# Altium project Flight Controller.PrjPcb
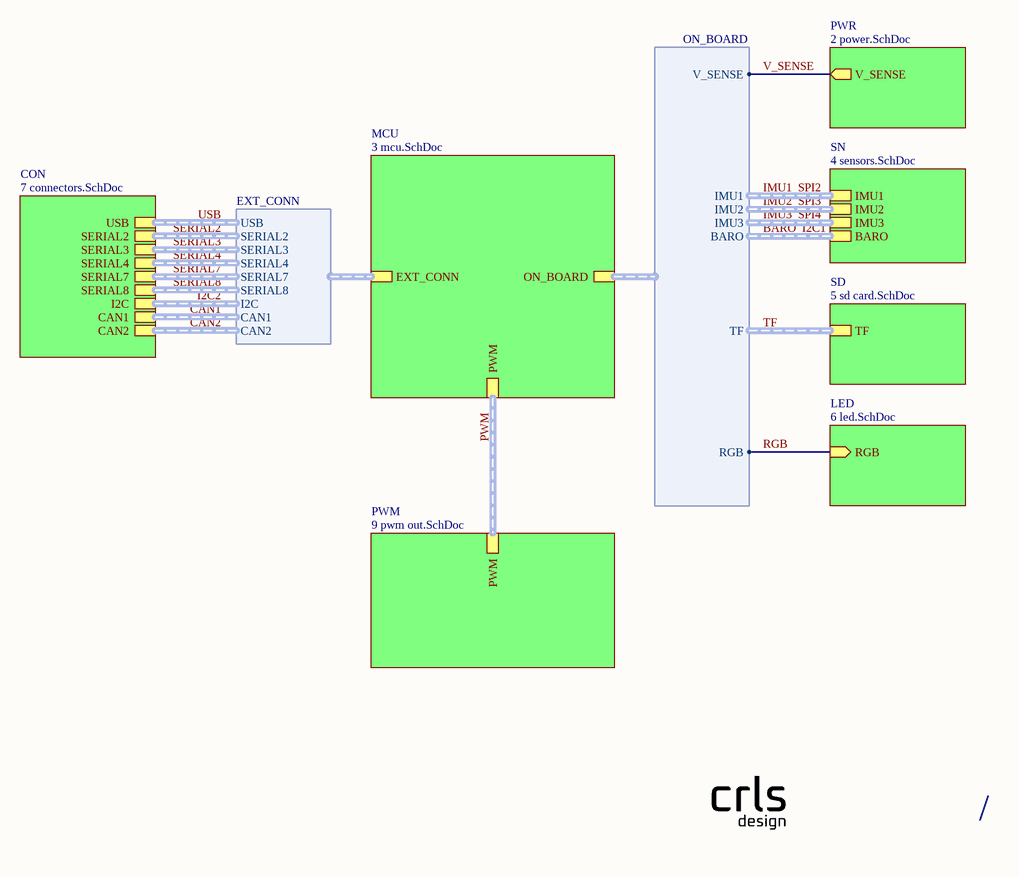
[diagram p0: 1 top.SchDoc]
9 sheets, 153 parts. Net scope: hierarchical (ports join the sheet entries above them; power ports are global).
Board files: main.PcbDoc, panel.PcbDoc
Sheets:
  1 top.SchDoc
    MCU = 3 mcu.SchDoc
    SN = 4 sensors.SchDoc
    SD = 5 sd card.SchDoc
    LED = 6 led.SchDoc
    PWR = 2 power.SchDoc
    CON = 7 connectors.SchDoc
      CT = 8 can transceiver.SchDoc
      CT = 8 can transceiver.SchDoc
    PWM = 9 pwm out.SchDoc

## Sheet 1 top.SchDoc
size A4; SheetNumber: 1; SheetTotal: 9

### Sub-sheets
CON = 7 connectors.SchDoc: USB, SERIAL2, SERIAL4, SERIAL8, CAN1, CAN2, I2C, SERIAL7, SERIAL3
LED = 6 led.SchDoc: RGB (in)
MCU = 3 mcu.SchDoc: ON_BOARD (harness ON_BOARD), EXT_CONN (harness EXT_CONN), PWM (harness PWM)
PWM = 9 pwm out.SchDoc: PWM (harness PWM)
PWR = 2 power.SchDoc: V_SENSE (out)
SD = 5 sd card.SchDoc: TF
SN = 4 sensors.SchDoc: IMU1, BARO, IMU2, IMU3

### Harnesses
ON_BOARD: IMU1, BARO, TF, RGB, V_SENSE, IMU2, IMU3
EXT_CONN: USB, SERIAL2, SERIAL3, SERIAL4, SERIAL7, SERIAL8, I2C, CAN1, CAN2

### Nets
RGB: sheet LED/RGB, sheet MCU/ON_BOARD.RGB
V_SENSE: sheet PWR/V_SENSE, sheet MCU/ON_BOARD.V_SENSE

### Buses and harness runs
harness BARO_I2C1 = sheet SN/BARO
harness CAN1 = sheet CON/CAN1
harness CAN2 = sheet CON/CAN2
harness I2C2 = sheet CON/I2C
harness IMU1_SPI2 = sheet SN/IMU1
harness IMU2_SPI3 = sheet SN/IMU2
harness IMU3_SPI4 = sheet SN/IMU3
harness PWM = sheet MCU/PWM = sheet PWM/PWM
harness SERIAL2 = sheet CON/SERIAL2
harness SERIAL3 = sheet CON/SERIAL3
harness SERIAL4 = sheet CON/SERIAL4
harness SERIAL7 = sheet CON/SERIAL7
harness SERIAL8 = sheet CON/SERIAL8
harness TF = sheet SD/TF
harness USB = sheet CON/USB

### Notes on the sheet
- /

## Sheet 3 mcu.SchDoc
size A4; SheetNumber: 3; SheetTotal: 9
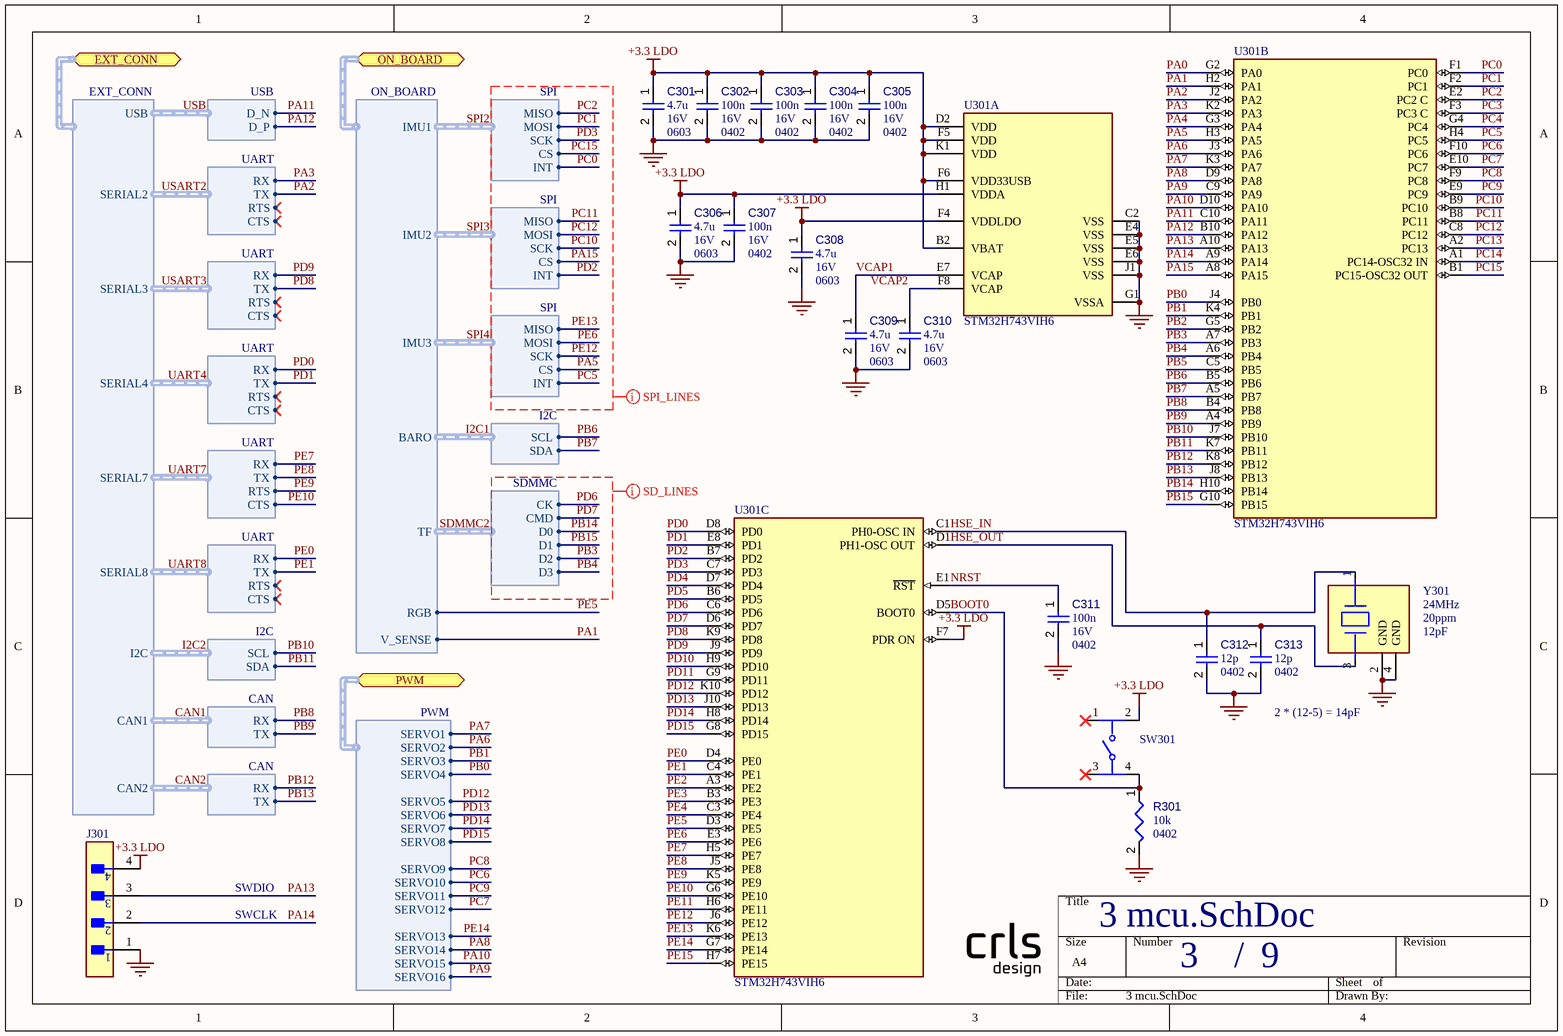
[diagram p1: 3 mcu.SchDoc]

### Parts
C301  value 4.7u  Case/Package: 0603  Voltage Rating: 16V  [CAPC0603(1608)100_L]  (hidden comment: Capacitors,0603,4.7u,16V)
C302  value 100n  Case/Package: 0402  Voltage Rating: 16V  [CAPC0402(1005)60_L]  (hidden comment: Capacitors,0402,100n,16V)
C303  value 100n  Case/Package: 0402  Voltage Rating: 16V  [CAPC0402(1005)60_L]  (hidden comment: Capacitors,0402,100n,16V)
C304  value 100n  Case/Package: 0402  Voltage Rating: 16V  [CAPC0402(1005)60_L]  (hidden comment: Capacitors,0402,100n,16V)
C305  value 100n  Case/Package: 0402  Voltage Rating: 16V  [CAPC0402(1005)60_L]  (hidden comment: Capacitors,0402,100n,16V)
C306  value 4.7u  Case/Package: 0603  Voltage Rating: 16V  [CAPC0603(1608)100_L]  (hidden comment: Capacitors,0603,4.7u,16V)
C307  value 100n  Case/Package: 0402  Voltage Rating: 16V  [CAPC0402(1005)60_L]  (hidden comment: Capacitors,0402,100n,16V)
C308  value 4.7u  Case/Package: 0603  Voltage Rating: 16V  [CAPC0603(1608)100_L]  (hidden comment: Capacitors,0603,4.7u,16V)
C309  value 4.7u  Case/Package: 0603  Voltage Rating: 16V  [CAPC0603(1608)100_L]  (hidden comment: Capacitors,0603,4.7u,16V)
C310  value 4.7u  Case/Package: 0603  Voltage Rating: 16V  [CAPC0603(1608)100_L]  (hidden comment: Capacitors,0603,4.7u,16V)
C311  value 100n  Case/Package: 0402  Voltage Rating: 16V  [CAPC0402(1005)60_L]  (hidden comment: Capacitors,0402,100n,16V)
C312  value 12p  Case/Package: 0402  [CAPC0402(1005)60_L]  (hidden comment: Capacitors,0402,12p)
C313  value 12p  Case/Package: 0402  [CAPC0402(1005)60_L]  (hidden comment: Capacitors,0402,12p)
J301  MTLW-104-05-G-S-185  [FP-MTLW-104-05-G-S-185-MFG]  (value not drawn)
R301  value 10k  Case/Package: 0402  [RESC0402(1005)_L]  (hidden comment: Resistors,0402,1%,10k)
SW301  PTS810 SJG 250 SMTR LFS  [FP-PTS810_SJG_250_SMTR_LF-MFG]  (value not drawn)
U301  STM32H743VIH6  [FP-TFBGA100-A08Q-MFG]  (parts A,B,C of 3)
Y301  Frequency Stability: 20ppm  Load Capacitance: 12pF  Frequency: 24MHz  [FP-TSX-3225-MFG]  (hidden comment: TSX-3225 24.0000MF20G-AC3)

### Ports
EXT_CONN (bidir, harness EXT_CONN), ON_BOARD (bidir, harness ON_BOARD), PWM (bidir, harness PWM)

### Harnesses
EXT_CONN: SERIAL2, SERIAL3, SERIAL4, SERIAL7, SERIAL8, USB, I2C, CAN1, CAN2
SPI: MISO, MOSI, SCK, CS, INT
I2C: SCL, SDA
CAN: RX, TX
ON_BOARD: IMU1, BARO, TF, RGB, V_SENSE, IMU2, IMU3
PWM: SERVO1, SERVO2, SERVO3, SERVO4, SERVO5, SERVO6, SERVO7, SERVO8, SERVO9, SERVO10, SERVO11, SERVO12, SERVO13, SERVO14, SERVO15, SERVO16
USB: D_N, D_P
UART: RX, TX, RTS, CTS
SDMMC: CK, CMD, D0, D1, D2, D3

### Nets
+3.3 LDO: C301.1 C302.1 C303.1 C304.1 C305.1 C306.1 C307.1 C308.1 J301.4 SW301.2 U301.B2(VBAT) U301.D2(VDD) U301.F4(VDDLDO) U301.F5(VDD) U301.F6(VDD33USB) U301.F7(PDR_ON) U301.H1(VDDA) U301.K1(VDD)
GND: C301.2 C302.2 C303.2 C304.2 C305.2 C306.2 C307.2 C308.2 C309.2 C310.2 C311.2 C312.2 C313.2 J301.1 R301.2 U301.C2(VSS) U301.E4(VSS) U301.E5(VSS) U301.E6(VSS) U301.G1(VSSA) U301.J1(VSS) Y301.2(GND) Y301.4(GND)
BOOT0: R301.1 SW301.4 U301.D5(BOOT0)
HSE_IN: C312.1 U301.C1(PH0-OSC_IN) Y301.1
HSE_OUT: C313.1 U301.D1(PH1-OSC_OUT) Y301.3
NRST: C311.1 U301.E1(~{RST})
PA0: U301.G2(PA0)
PA1: U301.H2(PA1) ; port ON_BOARD.V_SENSE  [project net V_SENSE]
PA2: U301.J2(PA2) ; harness UART.TX  [project net SERIAL2.TX]
PA3: U301.K2(PA3) ; harness UART.RX  [project net SERIAL2.RX]
PA4: U301.G3(PA4)
PA5: U301.H3(PA5) ; harness SPI.CS  [project net IMU3_SPI4.CS]
PA6: U301.J3(PA6) ; port PWM.SERVO2  [project net PWM.SERVO2]
PA7: U301.K3(PA7) ; port PWM.SERVO1  [project net PWM.SERVO1]
PA8: U301.D9(PA8) ; port PWM.SERVO14  [project net PWM.SERVO14]
PA9: U301.C9(PA9) ; port PWM.SERVO16  [project net PWM.SERVO16]
PA10: U301.D10(PA10) ; port PWM.SERVO15  [project net PWM.SERVO15]
PA11: U301.C10(PA11) ; harness USB.D_N  [project net USB.D_N]
PA12: U301.B10(PA12) ; harness USB.D_P  [project net USB.D_P]
PA13: J301.3 U301.A10(PA13)
PA14: J301.2 U301.A9(PA14)
PA15: U301.A8(PA15) ; harness SPI.CS  [project net IMU2_SPI3.CS]
PB0: U301.J4(PB0) ; port PWM.SERVO4  [project net PWM.SERVO4]
PB1: U301.K4(PB1) ; port PWM.SERVO3  [project net PWM.SERVO3]
PB2: U301.G5(PB2)
PB3: U301.A7(PB3) ; harness SDMMC.D2  [project net SDMMC2.D2]
PB4: U301.A6(PB4) ; harness SDMMC.D3  [project net SDMMC2.D3]
PB5: U301.C5(PB5)
PB6: U301.B5(PB6) ; harness I2C.SCL  [project net BARO_I2C1.SCL]
PB7: U301.A5(PB7) ; harness I2C.SDA  [project net BARO_I2C1.SDA]
PB8: U301.B4(PB8) ; harness CAN.RX  [project net CAN1.RX]
PB9: U301.A4(PB9) ; harness CAN.TX  [project net CAN1.TX]
PB10: U301.J7(PB10) ; harness I2C.SCL  [project net I2C2.SCL]
PB11: U301.K7(PB11) ; harness I2C.SDA  [project net I2C2.SDA]
PB12: U301.K8(PB12) ; harness CAN.RX  [project net CAN2.RX]
PB13: U301.J8(PB13) ; harness CAN.TX  [project net CAN2.TX]
PB14: U301.H10(PB14) ; harness SDMMC.D0  [project net SDMMC2.D0]
PB15: U301.G10(PB15) ; harness SDMMC.D1  [project net SDMMC2.D1]
PC0: U301.F1(PC0) ; harness SPI.INT  [project net IMU1_SPI2.INT]
PC1: U301.F2(PC1) ; harness SPI.MOSI  [project net IMU1_SPI2.MOSI]
PC2: U301.E2(PC2_C) ; harness SPI.MISO  [project net IMU1_SPI2.MISO]
PC3: U301.F3(PC3_C)
PC4: U301.G4(PC4)
PC5: U301.H4(PC5) ; harness SPI.INT  [project net IMU3_SPI4.INT]
PC6: U301.F10(PC6) ; port PWM.SERVO10  [project net PWM.SERVO10]
PC7: U301.E10(PC7) ; port PWM.SERVO12  [project net PWM.SERVO12]
PC8: U301.F9(PC8) ; port PWM.SERVO9  [project net PWM.SERVO9]
PC9: U301.E9(PC9) ; port PWM.SERVO11  [project net PWM.SERVO11]
PC10: U301.B9(PC10) ; harness SPI.SCK  [project net IMU2_SPI3.SCK]
PC11: U301.B8(PC11) ; harness SPI.MISO  [project net IMU2_SPI3.MISO]
PC12: U301.C8(PC12) ; harness SPI.MOSI  [project net IMU2_SPI3.MOSI]
PC13: U301.A2(PC13)
PC14: U301.A1(PC14-OSC32_IN)
PC15: U301.B1(PC15-OSC32_OUT) ; harness SPI.CS  [project net IMU1_SPI2.CS]
PD0: U301.D8(PD0) ; harness UART.RX  [project net SERIAL4.RX]
PD1: U301.E8(PD1) ; harness UART.TX  [project net SERIAL4.TX]
PD2: U301.B7(PD2) ; harness SPI.INT  [project net IMU2_SPI3.INT]
PD3: U301.C7(PD3) ; harness SPI.SCK  [project net IMU1_SPI2.SCK]
PD4: U301.D7(PD4)
PD5: U301.B6(PD5)
PD6: U301.C6(PD6) ; harness SDMMC.CK  [project net SDMMC2.CK]
PD7: U301.D6(PD7) ; harness SDMMC.CMD  [project net SDMMC2.CMD]
PD8: U301.K9(PD8) ; harness UART.TX  [project net SERIAL3.TX]
PD9: U301.J9(PD9) ; harness UART.RX  [project net SERIAL3.RX]
PD10: U301.H9(PD10)
PD11: U301.G9(PD11)
PD12: U301.K10(PD12) ; port PWM.SERVO5  [project net PWM.SERVO5]
PD13: U301.J10(PD13) ; port PWM.SERVO6  [project net PWM.SERVO6]
PD14: U301.H8(PD14) ; port PWM.SERVO7  [project net PWM.SERVO7]
PD15: U301.G8(PD15) ; port PWM.SERVO8  [project net PWM.SERVO8]
PE0: U301.D4(PE0) ; harness UART.RX  [project net SERIAL8.RX]
PE1: U301.C4(PE1) ; harness UART.TX  [project net SERIAL8.TX]
PE2: U301.A3(PE2)
PE3: U301.B3(PE3)
PE4: U301.C3(PE4)
PE5: U301.D3(PE5)
PE6: U301.E3(PE6) ; harness SPI.MOSI  [project net IMU3_SPI4.MOSI]
PE7: U301.H5(PE7) ; harness UART.RX  [project net SERIAL7.RX]
PE8: U301.J5(PE8) ; harness UART.TX  [project net SERIAL7.TX]
PE9: U301.K5(PE9) ; harness UART.RTS  [project net SERIAL7.RTS]
PE10: U301.G6(PE10) ; harness UART.CTS  [project net SERIAL7.CTS]
PE11: U301.H6(PE11)
PE12: U301.J6(PE12) ; harness SPI.SCK  [project net IMU3_SPI4.SCK]
PE13: U301.K6(PE13) ; harness SPI.MISO  [project net IMU3_SPI4.MISO]
PE14: U301.G7(PE14) ; port PWM.SERVO13  [project net PWM.SERVO13]
PE15: U301.H7(PE15)
VCAP1: C309.1 U301.E7(VCAP)
VCAP2: C310.1 U301.F8(VCAP)

Not connected (* = marked no-connect by the designer): SW301 1* 3*

### Layout directives
net class SPI_LINES: PA5, PA15, PC0, PC1, PC2, PC5, PC10, PC11, PC12, PC15, PD2, PD3, PE6, PE12, PE13, SPI2, SPI3, SPI4
net class SD_LINES: PB3, PB4, PB14, PB15, PD6, PD7, SDMMC2

### Notes on the sheet
- 2 * (12-5) = 14pF
- SWDIO
- SWCLK
- /

### Library data of the parts
C301-C313 = Capacitors: Capacitor; Component Type: Capacitors
J301 = CMP-02766-000562-1: CONN HEADER VERT 4POS 2.54MM; Number of Contacts: 4; Contact Resistance: 15mR; Connector Type: Male Pin; Gender: Male; Contact Material: Brass; Height: 6.4mm; Contact Mating Length: 0.185inch; Length: 29.64mm; Number of Positions: 4; Packaging: Rail/Tube; Mount: Through Hole; Depth: 2.48mm; Number of Rows: 1; Radiation Hardening: No; Housing Material: Polymer; Pitch: 2.54mm; Max Operating Temperature: 105°C; Termination: Solder; Min Operating Temperature: -40°C; Color: Black; Orientation: Straight; Housing Color: Black; Contact Plating: Gold
R301 = Resistors: Resistor; Tolerance: 1%; Component Type: Resistors
SW301 = CMP-10040-000011-1: SWITCH TACTILE SPST-NO 0.05A 16V; Manufacturer: C&K Components; Electromechanical Life: 100000Cycles; Contact Resistance: 500mΩ; Operating Force: 400gf; Current Rating: 50mA; Voltage Rating Dc: 16V; Device Class L2: Switches; Device Class L1: Electromechanical; ComponentLink2URL: https://www.ckswitches.com/media/1476/pts810.pdf; Digikey Description: SWITCH TACTILE SPST-NO 0.05A 16V; RoHS: TRUE; Temperature Range Low: -40°C; Temperature Range High: +85°C; Automotive: No; Category: Switch; ComponentLink2Description: Datasheet; Device Class L3: Tactile Switches; Mouser Description: Switch Tactile N.O. SPST Button J-Bend 0.05A 16VDC 100000Cycles 3.92N SMD T/R; Throw Configuration: SPST-NO; Package: PTS810 SJG 250 SMTR LFS; Height: 2.7mm; Octopart: https://octopart.com/pts810sjg250smtrlfs-c%26k+components-29380277; Manufacturer Part Number: PTS810 SJG 250 SMTR LFS; Temperature: -40°C to +85°C; Lead Free: Yes
U301 = CMP-12105-000020-1: HIGH-PERFORMANCE AND DSP WITH DP; Manufacturer: STMicroelectronics; Ram Size: 1MBytes; Number Of A/D Converters: 3; Number Of Usb Channels: 1; Number Of Pwm Channels: 2; Number Of Timers/Counters: 22; Memory Size: 2MBytes; Data Bus Width: 32bits; Max Junction Temp: +125°C; Max Supply Voltage: 3.6V; Standoff Height: 0.15mm; Frequency: 480MHz; Number Of Adc Channels: 36; Number Of I/Os: 82; Interface: I2C,SPI,UART,USART,CAN,USB,Ethernet,I2S,SMBus; Memory Type: FLASH; Number Of I2C Channels: 4; Number Of Spi Channels: 6; Core Architecture: ARM Cortex-M7; Number Of Uart Channels: 9; Min Supply Voltage: 1.71V; Temperature Range High: +85°C; Ambient Temperature Range High: +85°C; RoHS: TRUE; Device Class L1: Integrated Circuits (ICs); Package: TFBGA100-A08Q; Temperature: -40°C to +85°C; Octopart: https://octopart.com/stm32h743vih6-stmicroelectronics-93590710; Number Of Ethernet Channels: 1; Manufacturer Part Number: STM32H743VIH6; ComponentLink2Description: Datasheet; Category: IC; Digikey Description: HIGH-PERFORMANCE AND DSP WITH DP; Number Of Cores: 1; Device Class L3: Microcontrollers; Ambient Temperature Range Low: -40°C; Temperature Range Low: -40°C; Ipc Land Pattern Name: BGA100C80P10X10_800X800X110; Automotive: No; Device Class L2: Embedded Processors and Controllers; Height: 1.1mm; Lead Free: Yes; Mouser Description: MCU 32-Bit STM32H743VI ARM Cortex M7 RISC 2MB Flash 1.8V/2.5V/3.3V 100-Pin TFBGA Tray; ComponentLink2URL: https://www.st.com/resource/en/datasheet/stm32h743vi.pdf
Y301 = CMP-36405-000018-1: CRYSTAL 24.0000MHZ 9PF SMD; ESR (Equivalent Series Resistance): 40R; Tolerance: 10ppm; Drive Level: 200uW; Min Operating Temperature: -40°C; RoHS Compliant: Yes; Width: 2.5mm; Max Operating Temperature: 105°C; Package Quantity: 250; Mount: Surface Mount; Lead Free: Lead Free; Height: 0.024inch; Depth: 2.5mm; Packaging: Tape and Reel; Series: TSX-3225; Weight: 0.000564oz; Number of Pins: 4; Termination: SMD/SMT; Case/Package: SMD/SMT; Length: 3.2mm; Frequency Tolerance: 10ppm

## Sheet 4 sensors.SchDoc
size A4; SheetNumber: 4; SheetTotal: 9
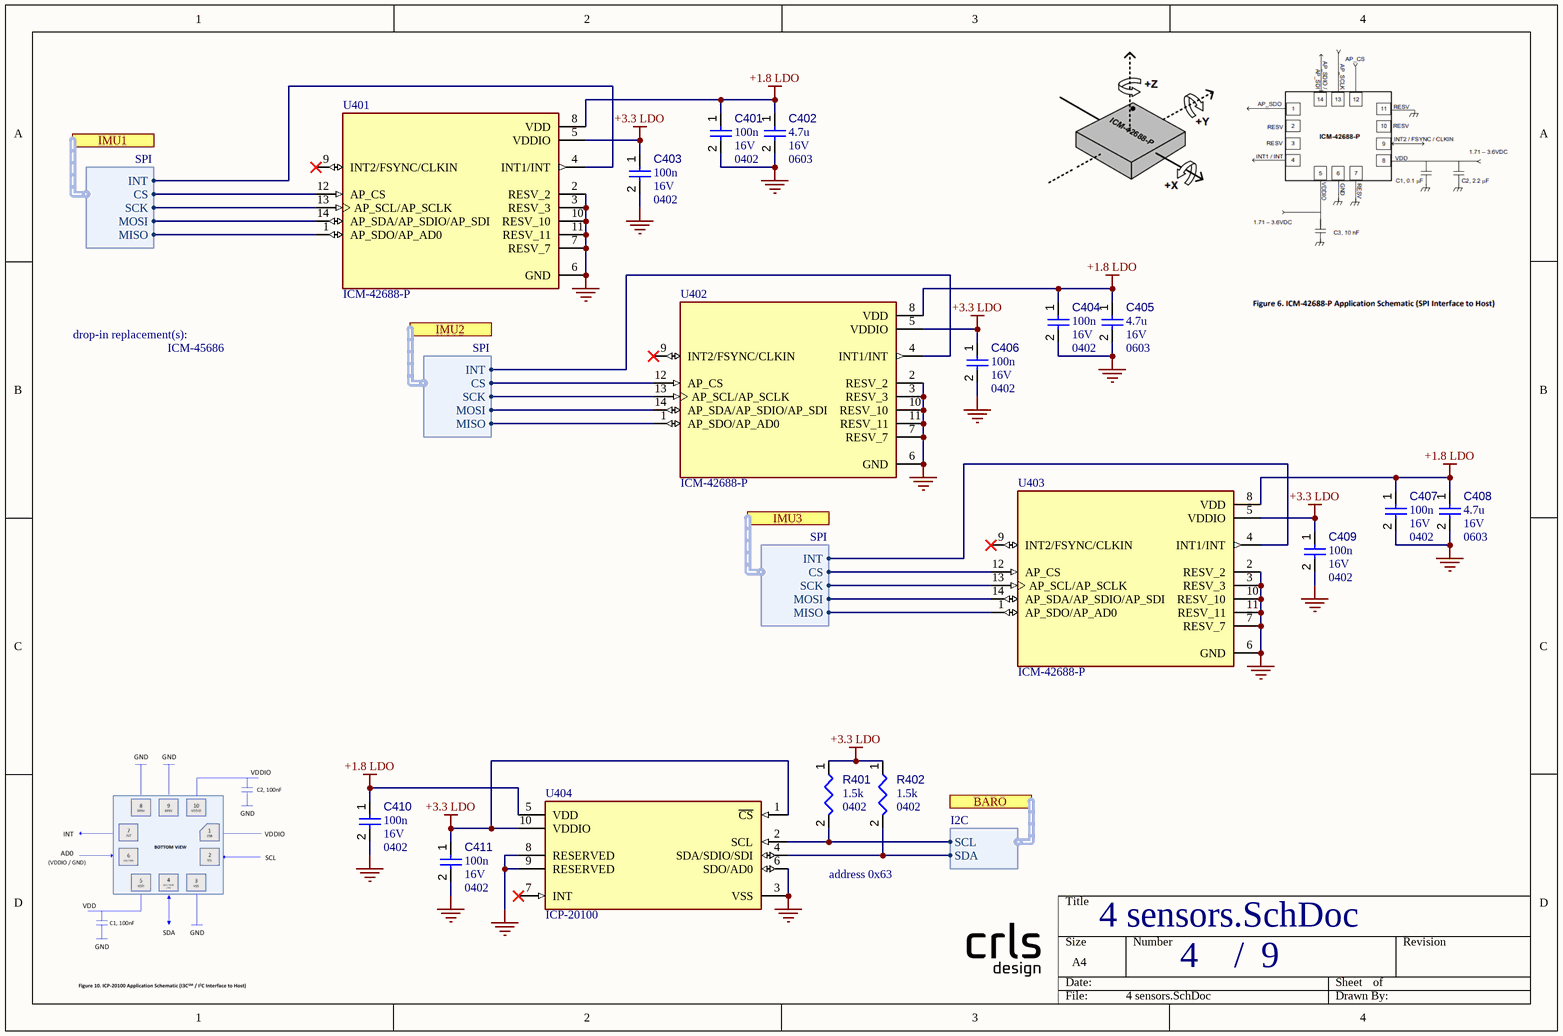
[diagram p2: 4 sensors.SchDoc]

### Parts
C401  value 100n  Case/Package: 0402  Voltage Rating: 16V  [CAPC0402(1005)60_L]  (hidden comment: Capacitors,0402,100n,16V)
C402  value 4.7u  Case/Package: 0603  Voltage Rating: 16V  [CAPC0603(1608)100_L]  (hidden comment: Capacitors,0603,4.7u,16V)
C403  value 100n  Case/Package: 0402  Voltage Rating: 16V  [CAPC0402(1005)60_L]  (hidden comment: Capacitors,0402,100n,16V)
C404  value 100n  Case/Package: 0402  Voltage Rating: 16V  [CAPC0402(1005)60_L]  (hidden comment: Capacitors,0402,100n,16V)
C405  value 4.7u  Case/Package: 0603  Voltage Rating: 16V  [CAPC0603(1608)100_L]  (hidden comment: Capacitors,0603,4.7u,16V)
C406  value 100n  Case/Package: 0402  Voltage Rating: 16V  [CAPC0402(1005)60_L]  (hidden comment: Capacitors,0402,100n,16V)
C407  value 100n  Case/Package: 0402  Voltage Rating: 16V  [CAPC0402(1005)60_L]  (hidden comment: Capacitors,0402,100n,16V)
C408  value 4.7u  Case/Package: 0603  Voltage Rating: 16V  [CAPC0603(1608)100_L]  (hidden comment: Capacitors,0603,4.7u,16V)
C409  value 100n  Case/Package: 0402  Voltage Rating: 16V  [CAPC0402(1005)60_L]  (hidden comment: Capacitors,0402,100n,16V)
C410  value 100n  Case/Package: 0402  Voltage Rating: 16V  [CAPC0402(1005)60_L]  (hidden comment: Capacitors,0402,100n,16V)
C411  value 100n  Case/Package: 0402  Voltage Rating: 16V  [CAPC0402(1005)60_L]  (hidden comment: Capacitors,0402,100n,16V)
R401  value 1.5k  Case/Package: 0402  [RESC0402(1005)_L]  (hidden comment: Resistors,0402,1%,1.5k)
R402  value 1.5k  Case/Package: 0402  [RESC0402(1005)_L]  (hidden comment: Resistors,0402,1%,1.5k)
U401  ICM-42688-P  [PQFN50P300X250X97-14N]
U402  ICM-42688-P  [PQFN50P300X250X97-14N]
U403  ICM-42688-P  [PQFN50P300X250X97-14N]
U404  ICP-20100  [FP-ICP-20100-MFG]

### Ports
BARO (harness I2C), IMU1 (harness SPI), IMU2 (harness SPI), IMU3 (harness SPI)

### Harnesses
SPI: MISO, MOSI, SCK, CS, INT
I2C: SCL, SDA

### Nets
+1.8 LDO: C401.1 C402.1 C404.1 C405.1 C407.1 C408.1 C410.1 U401.8(VDD) U402.8(VDD) U403.8(VDD) U404.5(VDD)
+3.3 LDO: C403.1 C406.1 C409.1 C411.1 R401.1 R402.1 U401.5(VDDIO) U402.5(VDDIO) U403.5(VDDIO) U404.1(~{CS}) U404.10(VDDIO)
GND: C401.2 C402.2 C403.2 C404.2 C405.2 C406.2 C407.2 C408.2 C409.2 C410.2 C411.2 U401.2(RESV_2) U401.3(RESV_3) U401.6(GND) U401.7(RESV_7) U401.10(RESV_10) U401.11(RESV_11) U402.2(RESV_2) U402.3(RESV_3) U402.6(GND) U402.7(RESV_7) U402.10(RESV_10) U402.11(RESV_11) U403.2(RESV_2) U403.3(RESV_3) U403.6(GND) U403.7(RESV_7) U403.10(RESV_10) U403.11(RESV_11) U404.3(VSS) U404.6(SDO/AD0) U404.8(RESERVED) U404.9(RESERVED)
BARO_I2C1.SCL: R401.2 U404.2(SCL) ; port BARO.SCL
BARO_I2C1.SDA: R402.2 U404.4(SDA/SDIO/SDI) ; port BARO.SDA
IMU1_SPI2.CS: U401.12(AP_CS) ; port IMU1.CS
IMU1_SPI2.INT: U401.4(INT1/INT) ; port IMU1.INT
IMU1_SPI2.MISO: U401.1(AP_SDO/AP_AD0) ; port IMU1.MISO
IMU1_SPI2.MOSI: U401.14(AP_SDA/AP_SDIO/AP_SDI) ; port IMU1.MOSI
IMU1_SPI2.SCK: U401.13(AP_SCL/AP_SCLK) ; port IMU1.SCK
IMU2_SPI3.CS: U402.12(AP_CS) ; port IMU2.CS
IMU2_SPI3.INT: U402.4(INT1/INT) ; port IMU2.INT
IMU2_SPI3.MISO: U402.1(AP_SDO/AP_AD0) ; port IMU2.MISO
IMU2_SPI3.MOSI: U402.14(AP_SDA/AP_SDIO/AP_SDI) ; port IMU2.MOSI
IMU2_SPI3.SCK: U402.13(AP_SCL/AP_SCLK) ; port IMU2.SCK
IMU3_SPI4.CS: U403.12(AP_CS) ; port IMU3.CS
IMU3_SPI4.INT: U403.4(INT1/INT) ; port IMU3.INT
IMU3_SPI4.MISO: U403.1(AP_SDO/AP_AD0) ; port IMU3.MISO
IMU3_SPI4.MOSI: U403.14(AP_SDA/AP_SDIO/AP_SDI) ; port IMU3.MOSI
IMU3_SPI4.SCK: U403.13(AP_SCL/AP_SCLK) ; port IMU3.SCK

Not connected (* = marked no-connect by the designer): U401 9(INT2/FSYNC/CLKIN)*; U402 9(INT2/FSYNC/CLKIN)*; U403 9(INT2/FSYNC/CLKIN)*; U404 7(INT)*

### Notes on the sheet
- drop-in replacement(s):
- ICM-45686
- address 0x63
- /

### Library data of the parts
C401-C411 = Capacitors: Capacitor; Component Type: Capacitors
R401 R402 = Resistors: Resistor; Tolerance: 1%; Component Type: Resistors
U401-U403 = ICM-42688-P: Accelerometer, Gyroscope, 6 Axis Sensor Output; Package: None; MP: ICM-42688-P; Value: *; Availability: Unavailable; Price: None
U404 = CMP-03292-111934633-1: ICP-20100 Barometric Pressure and Temperature Sensor IC Digital Output 1.8V/3.3V 10-Pin LGA T/R; Width: 2mm; Min Length: 1.92mm; Max Thickness: 800µm; NexarPartId: 111934633; Max Width: 2.08mm; Min Operating Temperature: -40°C; Max Length: 2.08mm; Min Width: 1.92mm; Min Thickness: 640µm; Length: 2mm

## Sheet 5 sd card.SchDoc
size A4; SheetNumber: 5; SheetTotal: 9
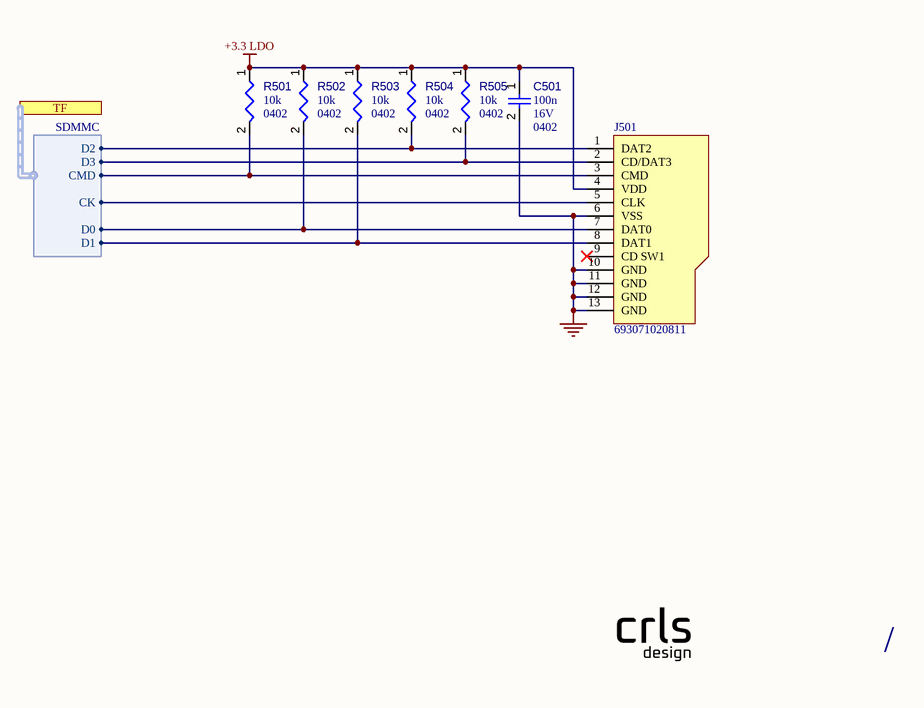
[diagram p3: 5 sd card.SchDoc]

### Parts
C501  value 100n  Case/Package: 0402  Voltage Rating: 16V  [CAPC0402(1005)60_L]  (hidden comment: Capacitors,0402,100n,16V)
J501  693071020811  [693071020811]
R501  value 10k  Case/Package: 0402  [RESC0402(1005)_L]  (hidden comment: Resistors,0402,1%,10k)
R502  value 10k  Case/Package: 0402  [RESC0402(1005)_L]  (hidden comment: Resistors,0402,1%,10k)
R503  value 10k  Case/Package: 0402  [RESC0402(1005)_L]  (hidden comment: Resistors,0402,1%,10k)
R504  value 10k  Case/Package: 0402  [RESC0402(1005)_L]  (hidden comment: Resistors,0402,1%,10k)
R505  value 10k  Case/Package: 0402  [RESC0402(1005)_L]  (hidden comment: Resistors,0402,1%,10k)

### Ports
TF (harness SDMMC)

### Harnesses
SDMMC: CK, CMD, D0, D1, D2, D3

### Nets
+3.3 LDO: C501.1 J501.4(VDD) R501.1 R502.1 R503.1 R504.1 R505.1
GND: C501.2 J501.6(VSS) J501.10(GND) J501.11(GND) J501.12(GND) J501.13(GND)
SDMMC2.CK: J501.5(CLK) ; port TF.CK
SDMMC2.CMD: J501.3(CMD) R501.2 ; port TF.CMD
SDMMC2.D0: J501.7(DAT0) R502.2 ; port TF.D0
SDMMC2.D1: J501.8(DAT1) R503.2 ; port TF.D1
SDMMC2.D2: J501.1(DAT2) R504.2 ; port TF.D2
SDMMC2.D3: J501.2(CD/DAT3) R505.2 ; port TF.D3

Not connected (* = marked no-connect by the designer): J501 9(CD_SW1)*

### Notes on the sheet
- /

### Library data of the parts
C501 = Capacitors: Capacitor; Component Type: Capacitors
J501 = CMP-03913-107725714-1: 693071020811 Micro Sd Card, Push-Push, 8Pos, Smt Rohs Compliant: Yes; Current Rating: 500mA; Insulation Resistance: 100MΩ; Min Operating Temperature: -40°C; Number of Pins: 8; Packaging: Tape and Reel; RoHS: Compliant; NexarPartId: 107725714; Max Operating Temperature: 85°C
R501-R505 = Resistors: Resistor; Tolerance: 1%; Component Type: Resistors

## Sheet 6 led.SchDoc
size A4; SheetNumber: 6; SheetTotal: 9
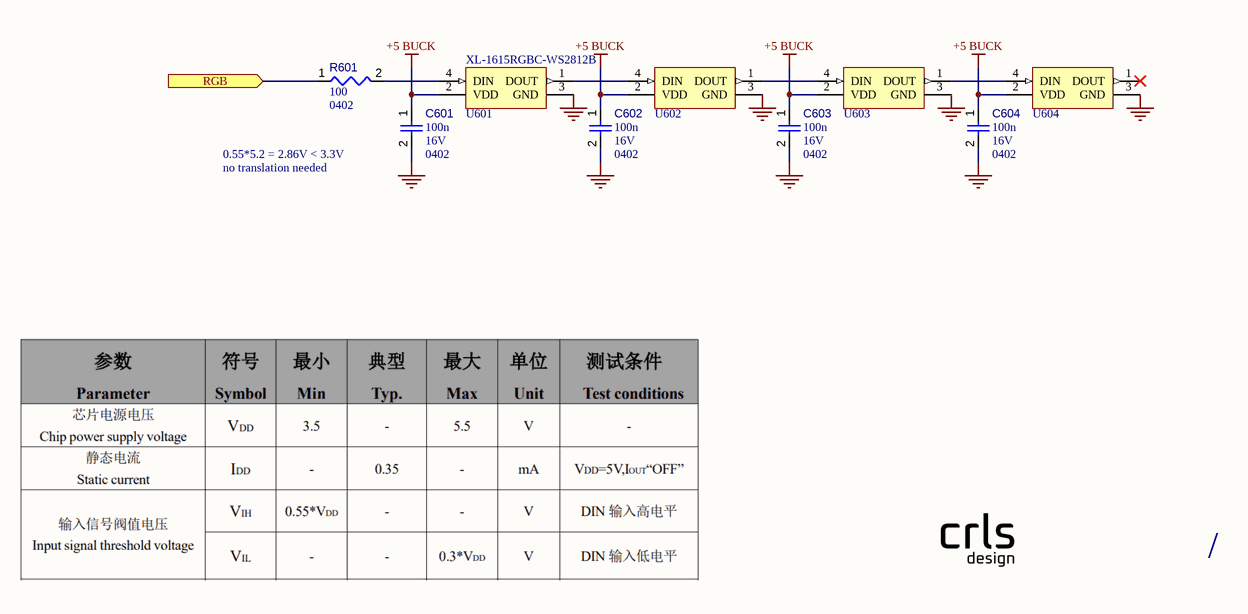
[diagram p4: 6 led.SchDoc]

### Parts
C601  value 100n  Case/Package: 0402  Voltage Rating: 16V  [CAPC0402(1005)60_L]  (hidden comment: Capacitors,0402,100n,16V)
C602  value 100n  Case/Package: 0402  Voltage Rating: 16V  [CAPC0402(1005)60_L]  (hidden comment: Capacitors,0402,100n,16V)
C603  value 100n  Case/Package: 0402  Voltage Rating: 16V  [CAPC0402(1005)60_L]  (hidden comment: Capacitors,0402,100n,16V)
C604  value 100n  Case/Package: 0402  Voltage Rating: 16V  [CAPC0402(1005)60_L]  (hidden comment: Capacitors,0402,100n,16V)
R601  value 100  Case/Package: 0402  [RESC0402(1005)_L]  (hidden comment: Resistors,0402,1%,100)
U601  XL-1615RGBC-WS2812B  [WS2812B 1615]
U602  XL-1615RGBC-WS2812B  [WS2812B 1615]  (value not drawn)
U603  XL-1615RGBC-WS2812B  [WS2812B 1615]  (value not drawn)
U604  XL-1615RGBC-WS2812B  [WS2812B 1615]  (value not drawn)

### Ports
RGB (in)

### Nets
+5 BUCK: C601.1 C602.1 C603.1 C604.1 U601.2(VDD) U602.2(VDD) U603.2(VDD) U604.2(VDD)
GND: C601.2 C602.2 C603.2 C604.2 U601.3(GND) U602.3(GND) U603.3(GND) U604.3(GND)
RGB: R601.1 ; port RGB
NetR601_2: R601.2 U601.4(DIN)
NetU601_1: U601.1(DOUT) U602.4(DIN)
NetU602_1: U602.1(DOUT) U603.4(DIN)
NetU603_1: U603.1(DOUT) U604.4(DIN)

Not connected (* = marked no-connect by the designer): U604 1(DOUT)*

### Notes on the sheet
- 0.55*5.2 = 2.86V < 3.3V
- no translation needed
- /

### Library data of the parts
C601-C604 = Capacitors: Capacitor; Component Type: Capacitors
R601 = Resistors: Resistor; Tolerance: 1%; Component Type: Resistors
U601-U604 = WS2812B 1615

## Sheet 2 power.SchDoc
size A4; SheetNumber: 2; SheetTotal: 9
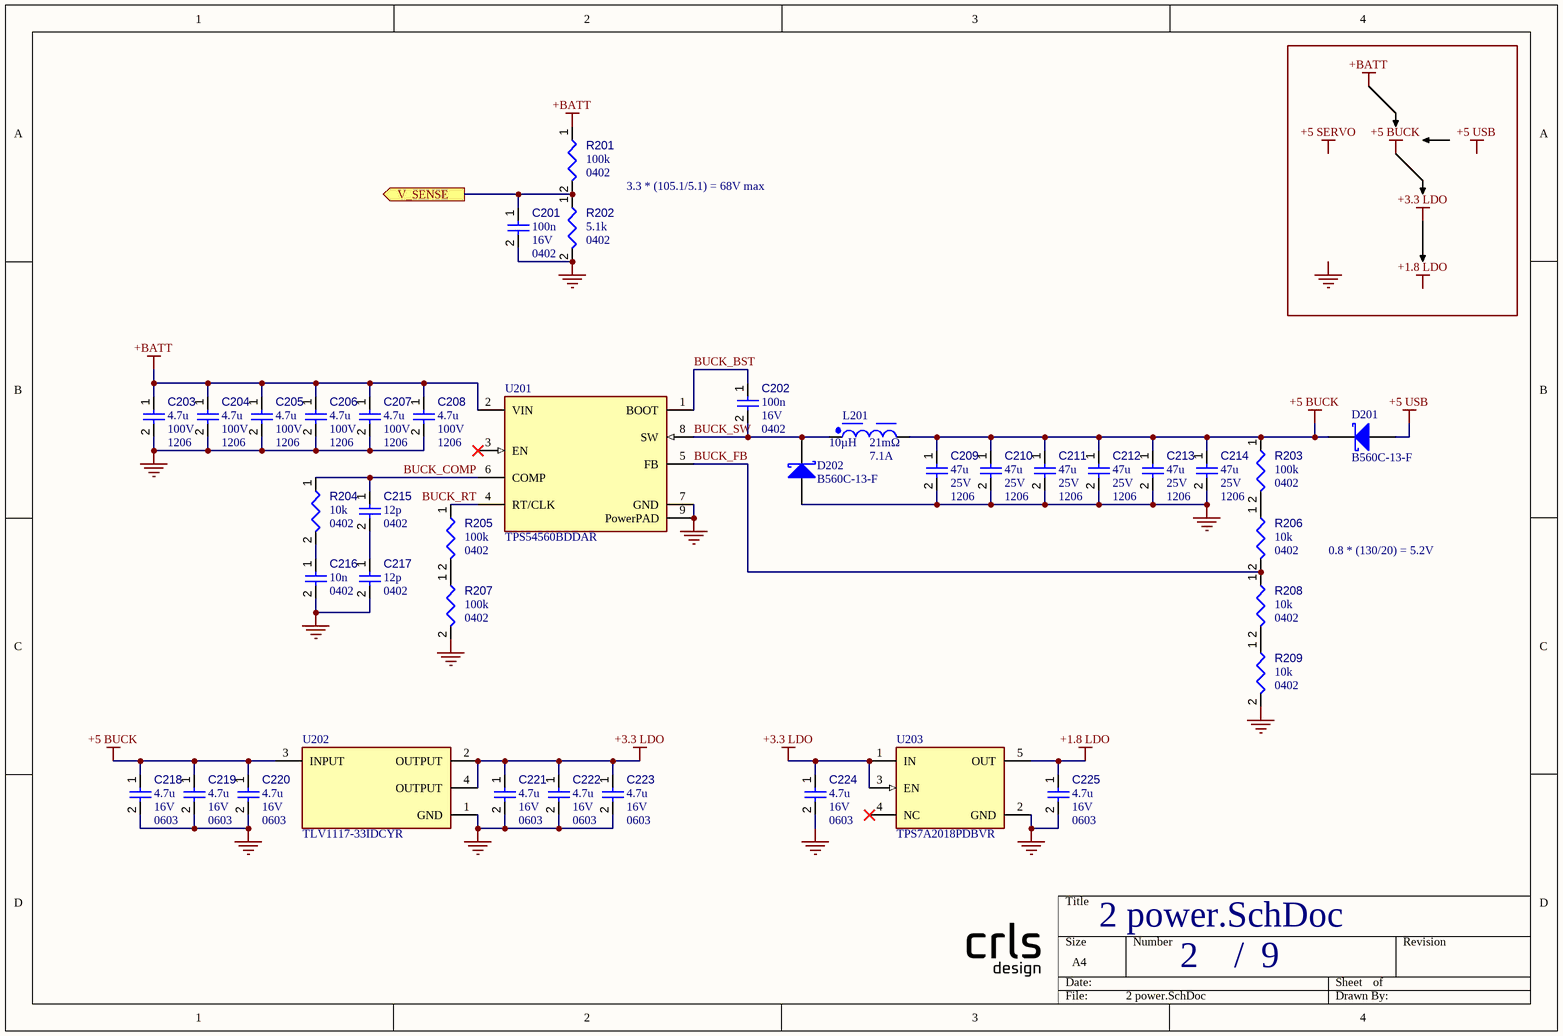
[diagram p5: 2 power.SchDoc]

### Parts
C201  value 100n  Case/Package: 0402  Voltage Rating: 16V  [CAPC0402(1005)60_L]  (hidden comment: Capacitors,0402,100n,16V)
C202  value 100n  Case/Package: 0402  Voltage Rating: 16V  [CAPC0402(1005)60_L]  (hidden comment: Capacitors,0402,100n,16V)
C203  value 4.7u  Case/Package: 1206  Voltage Rating: 100V  [CAPC3216X180X50NL20T25]  (hidden comment: Capacitors,1206,4.7u,100V)
C204  value 4.7u  Case/Package: 1206  Voltage Rating: 100V  [CAPC3216X180X50NL20T25]  (hidden comment: Capacitors,1206,4.7u,100V)
C205  value 4.7u  Case/Package: 1206  Voltage Rating: 100V  [CAPC3216X180X50NL20T25]  (hidden comment: Capacitors,1206,4.7u,100V)
C206  value 4.7u  Case/Package: 1206  Voltage Rating: 100V  [CAPC3216X180X50NL20T25]  (hidden comment: Capacitors,1206,4.7u,100V)
C207  value 4.7u  Case/Package: 1206  Voltage Rating: 100V  [CAPC3216X180X50NL20T25]  (hidden comment: Capacitors,1206,4.7u,100V)
C208  value 4.7u  Case/Package: 1206  Voltage Rating: 100V  [CAPC3216X180X50NL20T25]  (hidden comment: Capacitors,1206,4.7u,100V)
C209  value 47u  Case/Package: 1206  Voltage Rating: 25V  [CAPC3216X180X50NL20T25]  (hidden comment: Capacitors,1206,47u,25V)
C210  value 47u  Case/Package: 1206  Voltage Rating: 25V  [CAPC3216X180X50NL20T25]  (hidden comment: Capacitors,1206,47u,25V)
C211  value 47u  Case/Package: 1206  Voltage Rating: 25V  [CAPC3216X180X50NL20T25]  (hidden comment: Capacitors,1206,47u,25V)
C212  value 47u  Case/Package: 1206  Voltage Rating: 25V  [CAPC3216X180X50NL20T25]  (hidden comment: Capacitors,1206,47u,25V)
C213  value 47u  Case/Package: 1206  Voltage Rating: 25V  [CAPC3216X180X50NL20T25]  (hidden comment: Capacitors,1206,47u,25V)
C214  value 47u  Case/Package: 1206  Voltage Rating: 25V  [CAPC3216X180X50NL20T25]  (hidden comment: Capacitors,1206,47u,25V)
C215  value 12p  Case/Package: 0402  [CAPC0402(1005)60_L]  (hidden comment: Capacitors,0402,12p)
C216  value 10n  Case/Package: 0402  [CAPC0402(1005)60_L]  (hidden comment: Capacitors,0402,10n)
C217  value 12p  Case/Package: 0402  [CAPC0402(1005)60_L]  (hidden comment: Capacitors,0402,12p)
C218  value 4.7u  Case/Package: 0603  Voltage Rating: 16V  [CAPC0603(1608)100_L]  (hidden comment: Capacitors,0603,4.7u,16V)
C219  value 4.7u  Case/Package: 0603  Voltage Rating: 16V  [CAPC0603(1608)100_L]  (hidden comment: Capacitors,0603,4.7u,16V)
C220  value 4.7u  Case/Package: 0603  Voltage Rating: 16V  [CAPC0603(1608)100_L]  (hidden comment: Capacitors,0603,4.7u,16V)
C221  value 4.7u  Case/Package: 0603  Voltage Rating: 16V  [CAPC0603(1608)100_L]  (hidden comment: Capacitors,0603,4.7u,16V)
C222  value 4.7u  Case/Package: 0603  Voltage Rating: 16V  [CAPC0603(1608)100_L]  (hidden comment: Capacitors,0603,4.7u,16V)
C223  value 4.7u  Case/Package: 0603  Voltage Rating: 16V  [CAPC0603(1608)100_L]  (hidden comment: Capacitors,0603,4.7u,16V)
C224  value 4.7u  Case/Package: 0603  Voltage Rating: 16V  [CAPC0603(1608)100_L]  (hidden comment: Capacitors,0603,4.7u,16V)
C225  value 4.7u  Case/Package: 0603  Voltage Rating: 16V  [CAPC0603(1608)100_L]  (hidden comment: Capacitors,0603,4.7u,16V)
D201  B560C-13-F  [DIOD-B5X0C-2_N]
D202  B560C-13-F  [DIOD-B5X0C-2_N]
L201  Max DC Current: 7.1A  Series Resistance: 21mΩ  Inductance: 10µH  [WE-PD_1210]  (hidden comment: 7447709100)
R201  value 100k  Case/Package: 0402  [RESC0402(1005)_L]  (hidden comment: Resistors,0402,1%,100k)
R202  value 5.1k  Case/Package: 0402  [RESC0402(1005)_L]  (hidden comment: Resistors,0402,1%,5.1k)
R203  value 100k  Case/Package: 0402  [RESC0402(1005)_L]  (hidden comment: Resistors,0402,1%,100k)
R204  value 10k  Case/Package: 0402  [RESC0402(1005)_L]  (hidden comment: Resistors,0402,1%,10k)
R205  value 100k  Case/Package: 0402  [RESC0402(1005)_L]  (hidden comment: Resistors,0402,1%,100k)
R206  value 10k  Case/Package: 0402  [RESC0402(1005)_L]  (hidden comment: Resistors,0402,1%,10k)
R207  value 100k  Case/Package: 0402  [RESC0402(1005)_L]  (hidden comment: Resistors,0402,1%,100k)
R208  value 10k  Case/Package: 0402  [RESC0402(1005)_L]  (hidden comment: Resistors,0402,1%,10k)
R209  value 10k  Case/Package: 0402  [RESC0402(1005)_L]  (hidden comment: Resistors,0402,1%,10k)
U201  TPS54560BDDAR  [FP-DDA0008E-IPC_C]
U202  TLV1117-33IDCYR  [FP-DCY0004A-MFG]
U203  TPS7A2018PDBVR  [FP-DBV0005A-MFG]

### Ports
V_SENSE (out)

### Nets
+1.8 LDO: C225.1 U203.5(OUT)
+3.3 LDO: C221.1 C222.1 C223.1 C224.1 U202.2(OUTPUT) U202.4(OUTPUT) U203.1(IN) U203.3(EN)
+5 BUCK: C209.1 C210.1 C211.1 C212.1 C213.1 C214.1 C218.1 C219.1 C220.1 D201.1(K) L201.2 R203.1 U202.3(INPUT)
+5 USB: D201.2(A)
+BATT: C203.1 C204.1 C205.1 C206.1 C207.1 C208.1 R201.1 U201.2(VIN)
GND: C201.2 C203.2 C204.2 C205.2 C206.2 C207.2 C208.2 C209.2 C210.2 C211.2 C212.2 C213.2 C214.2 C216.2 C217.2 C218.2 C219.2 C220.2 C221.2 C222.2 C223.2 C224.2 C225.2 D202.2(A) R202.2 R207.2 R209.2 U201.7(GND) U201.9(PowerPAD) U202.1(GND) U203.2(GND)
BUCK_BST: C202.1 U201.1(BOOT)
BUCK_COMP: C215.1 R204.1 U201.6(COMP)
BUCK_FB: R206.2 R208.1 U201.5(FB)
BUCK_RT: R205.1 U201.4(RT/CLK)
BUCK_SW: C202.2 D202.1(K) L201.1 U201.8(SW)
V_SENSE: C201.1 R201.2 R202.1 ; port V_SENSE
NetC215_2: C215.2 C217.1
NetC216_1: C216.1 R204.2
NetR203_2: R203.2 R206.1
NetR205_2: R205.2 R207.1
NetR208_2: R208.2 R209.1

Not connected (* = marked no-connect by the designer): U201 3(EN)*; U203 4(NC)*

### Notes on the sheet
- 3.3 * (105.1/5.1) = 68V max
- 0.8 * (130/20) = 5.2V
- /
- Labels drawn without touching a wire or pin: +1.8 LDO, +3.3 LDO, +5 BUCK, +5 SERVO, +5 USB, +BATT, GND

### Library data of the parts
C201-C225 = Capacitors: Capacitor; Component Type: Capacitors
D201 D202 = CMP-2000-05098-2: Schottky Barrier Rectifier, 5 A, 60 V, -55 to 125 degC, 2-Pin SMD, RoHS, Tape and Reel; Ir - Reverse Current: 500uA; Configuration: Single; Ifsm - Forward Surge Current: 100A; Vrrm - Repetitive Reverse Voltage: 60V; Brand: DiodesIncorporated; Vf - Forward Voltage: 0.7V; If - Forward Current: 5A; Unit Weight: 0.007408oz; Type: SchottkyBarrierRectifier; Package / Case: SMC; Manufacturer URL: http://www.diodes.com/; Datasheet URL: https://datasheet.ciiva.com/27052/1538961-27052355.pdf; Factory Pack Quantity: 3000; Height: 2.5mm; Width: 6.22mm; Product Category: SchottkyDiodes&Rectifiers; Minimum Operating Temperature: -55C; Manufacturer: DiodesIncorporated; Datasheet Version: Rev. 7-2, 06/2007; Product: SchottkyDiodes; Maximum Operating Temperature: +125C; Operating Temperature Range: -55Cto+125C; Technology: Si; Length: 7.11mm; RoHS: True; Packaging: Reel; Termination Style: SMD/SMT; Series: B560; Mounting Style: SMD/SMT
L201 = CMP-0227-00034-2: NexarPartId: 21642419; Core Material: Ferrite; DC Resistance (DCR): 13mΩ; Test Frequency: 1kHz; Tolerance: 20%; Saturation Current: 10.5A; Self Resonant Frequency: 21MHz; Shielding: Shielded; Ambient Temperature Range Low: -40°C; Number of Pins: 2; Height - Seated (Max): 10.0076mm; Length: 12mm; Max Operating Temperature: 125°C; Width: 12mm; Case Code (Metric): 3225; Composition: Wirewound; REACH SVHC: Unknown; Case/Package: Nonstandard; Packaging: Tape & Reel (TR); RoHS: Compliant; Current Rating: 7.1A; Min Operating Temperature: -40°C; Resistance: 21mΩ; Inductance Tolerance: 20%; Lead Pitch: 7mm; Case Code (Imperial): 1210; Height: 10mm; Ambient Temperature Range High: 85°C; Mount: Surface Mount; Weight: 4.535924g; Lead Free: Lead Free; Depth: 12mm; Termination: SMD/SMT; RMS Current (Irms): 7.1A
R201-R209 = Resistors: Resistor; Tolerance: 1%; Component Type: Resistors
U201 = CMP-04918-000346-1: IC REG CTRLR
U202 = CMP-04917-000056-1: IC REG LIN 3.3V 800MA SOT223-4; Manufacturer: Texas Instruments; Nominal Supply Current: 5mA; Dropout Voltage: 1.2V; Max Supply Voltage: 15V; Min Supply Voltage: 4.7V; Output Type: Fixed; Number Of Outputs: 1; Output Current: 0.8A; Standoff Height: 0.02mm; Max Junction Temp: +125°C; Lead Free: Yes; RoHS: TRUE; Temperature: -40°C to +125°C; Device Class L1: Integrated Circuits (ICs); Output Voltage: 3.3V; Device Class L3: Voltage Regulators - Linear; Octopart: https://octopart.com/tlv1117-33idcyr-texas+instruments-669250; Device Class L2: Power Management ICs; Package: DCY0004A; Temperature Range High: +125°C; Category: IC; Height: 1.8mm; Automotive: No; Digikey Description: IC REG LIN 3.3V 800MA SOT223-4; Temperature Range Low: -40°C; ComponentLink2URL: http://www.ti.com/lit/ds/symlink/tlv1117.pdf; ComponentLink2Description: Datasheet; Manufacturer Part Number: TLV1117-33IDCYR; Mouser Description: LDO Voltage Regulators Fixed LDO Volt Reg
U203 = CMP-04917-000324-1: IC REG LINEAR 1.8V 300MA SOT23-5; RoHS Compliant: Yes

## Sheet 7 connectors.SchDoc
size A4; SheetNumber: 7; SheetTotal: 9
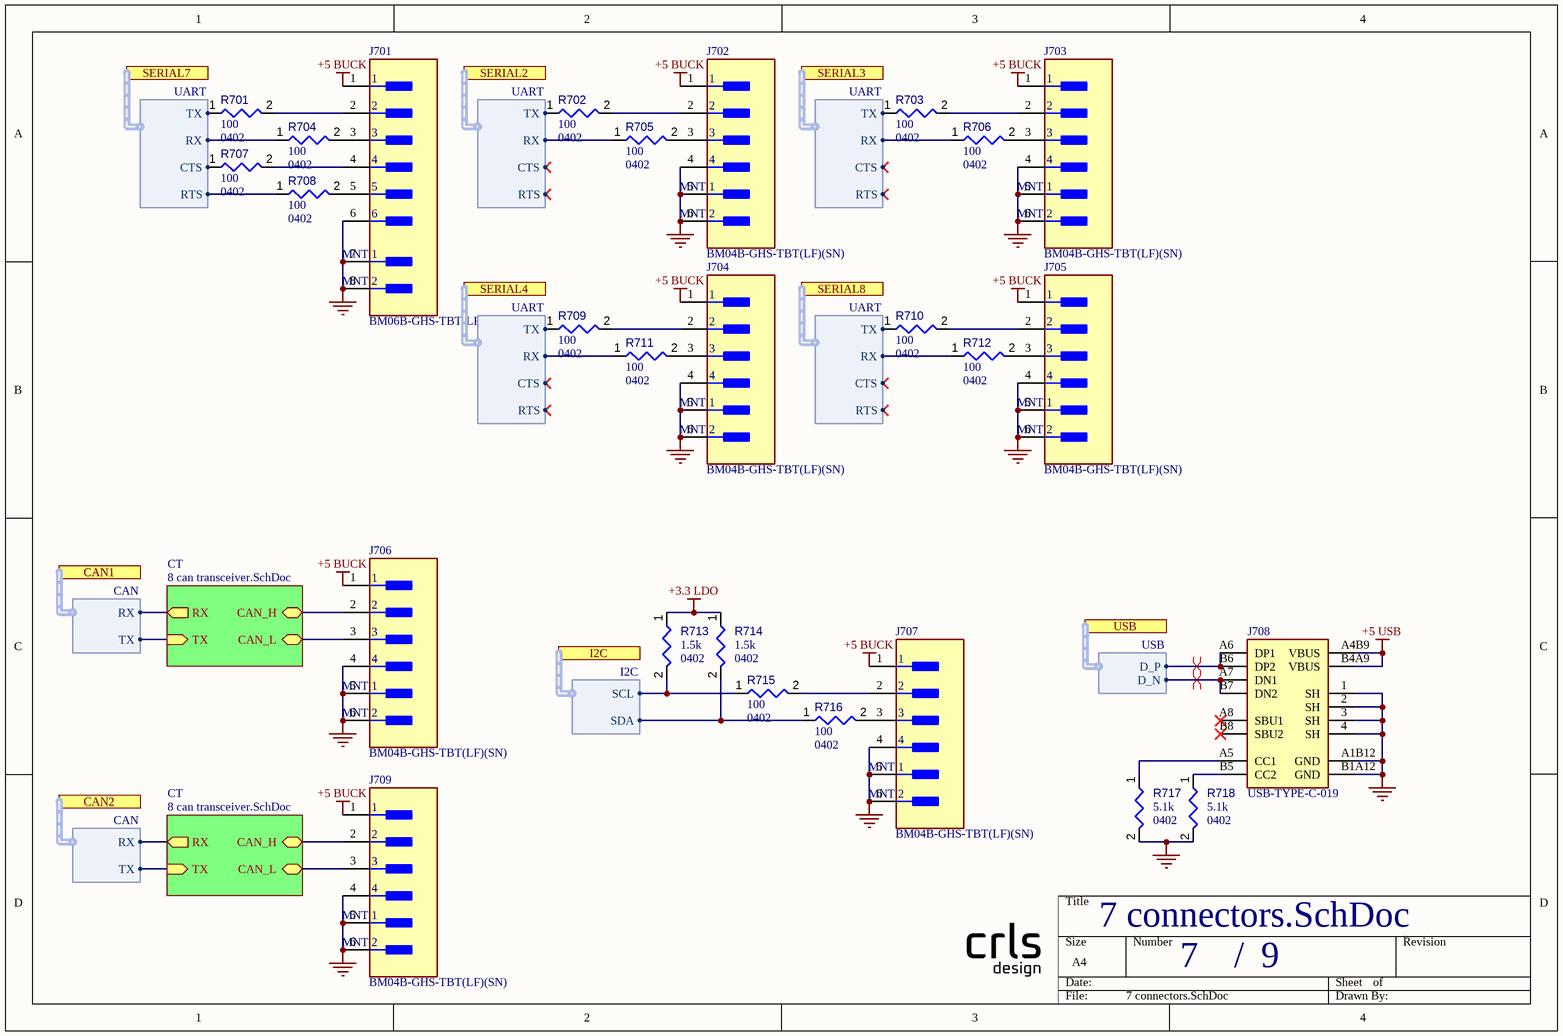
[diagram p6: 7 connectors.SchDoc]

### Parts
J701  BM06B-GHS-TBT(LF)(SN)  [FP-BM06B-GHS-TBT_LF_SN-MFG]
J702  BM04B-GHS-TBT(LF)(SN)  [FP-BM04B-GHS-TBT_LF_SN-MFG]
J703  BM04B-GHS-TBT(LF)(SN)  [FP-BM04B-GHS-TBT_LF_SN-MFG]
J704  BM04B-GHS-TBT(LF)(SN)  [FP-BM04B-GHS-TBT_LF_SN-MFG]
J705  BM04B-GHS-TBT(LF)(SN)  [FP-BM04B-GHS-TBT_LF_SN-MFG]
J706  BM04B-GHS-TBT(LF)(SN)  [FP-BM04B-GHS-TBT_LF_SN-MFG]
J707  BM04B-GHS-TBT(LF)(SN)  [FP-BM04B-GHS-TBT_LF_SN-MFG]
J708  USB-TYPE-C-019  [USB-TYPE-C-12+4P]
J709  BM04B-GHS-TBT(LF)(SN)  [FP-BM04B-GHS-TBT_LF_SN-MFG]
R701  value 100  Case/Package: 0402  [RESC0402(1005)_L]  (hidden comment: Resistors,0402,1%,100)
R702  value 100  Case/Package: 0402  [RESC0402(1005)_L]  (hidden comment: Resistors,0402,1%,100)
R703  value 100  Case/Package: 0402  [RESC0402(1005)_L]  (hidden comment: Resistors,0402,1%,100)
R704  value 100  Case/Package: 0402  [RESC0402(1005)_L]  (hidden comment: Resistors,0402,1%,100)
R705  value 100  Case/Package: 0402  [RESC0402(1005)_L]  (hidden comment: Resistors,0402,1%,100)
R706  value 100  Case/Package: 0402  [RESC0402(1005)_L]  (hidden comment: Resistors,0402,1%,100)
R707  value 100  Case/Package: 0402  [RESC0402(1005)_L]  (hidden comment: Resistors,0402,1%,100)
R708  value 100  Case/Package: 0402  [RESC0402(1005)_L]  (hidden comment: Resistors,0402,1%,100)
R709  value 100  Case/Package: 0402  [RESC0402(1005)_L]  (hidden comment: Resistors,0402,1%,100)
R710  value 100  Case/Package: 0402  [RESC0402(1005)_L]  (hidden comment: Resistors,0402,1%,100)
R711  value 100  Case/Package: 0402  [RESC0402(1005)_L]  (hidden comment: Resistors,0402,1%,100)
R712  value 100  Case/Package: 0402  [RESC0402(1005)_L]  (hidden comment: Resistors,0402,1%,100)
R713  value 1.5k  Case/Package: 0402  [RESC0402(1005)_L]  (hidden comment: Resistors,0402,1%,1.5k)
R714  value 1.5k  Case/Package: 0402  [RESC0402(1005)_L]  (hidden comment: Resistors,0402,1%,1.5k)
R715  value 100  Case/Package: 0402  [RESC0402(1005)_L]  (hidden comment: Resistors,0402,1%,100)
R716  value 100  Case/Package: 0402  [RESC0402(1005)_L]  (hidden comment: Resistors,0402,1%,100)
R717  value 5.1k  Case/Package: 0402  [RESC0402(1005)_L]  (hidden comment: Resistors,0402,1%,5.1k)
R718  value 5.1k  Case/Package: 0402  [RESC0402(1005)_L]  (hidden comment: Resistors,0402,1%,5.1k)

### Sub-sheets
CT = 8 can transceiver.SchDoc: RX (out), TX (in), CAN_H (bidir), CAN_L (bidir)
CT = 8 can transceiver.SchDoc: RX (out), TX (in), CAN_H (bidir), CAN_L (bidir)

### Ports
CAN1 (harness CAN), CAN2 (harness CAN), I2C (harness I2C), SERIAL2 (harness UART), SERIAL3 (harness UART), SERIAL4 (harness UART), SERIAL7 (harness UART), SERIAL8 (harness UART), USB (harness USB)

### Harnesses
UART: RX, TX, RTS, CTS
I2C: SCL, SDA
USB: D_N, D_P
CAN: RX, TX

### Nets
+3.3 LDO: R713.1 R714.1
+5 BUCK: J701.1 J702.1 J703.1 J704.1 J705.1 J706.1 J707.1 J709.1
+5 USB: J708.A4B9(VBUS) J708.B4A9(VBUS)
GND: J701.6 J701.7(MNT_1) J701.8(MNT_2) J702.4 J702.5(MNT_1) J702.6(MNT_2) J703.4 J703.5(MNT_1) J703.6(MNT_2) J704.4 J704.5(MNT_1) J704.6(MNT_2) J705.4 J705.5(MNT_1) J705.6(MNT_2) J706.4 J706.5(MNT_1) J706.6(MNT_2) J707.4 J707.5(MNT_1) J707.6(MNT_2) J708.1(SH) J708.2(SH) J708.3(SH) J708.4(SH) J708.A1B12(GND) J708.B1A12(GND) J709.4 J709.5(MNT_1) J709.6(MNT_2) R717.2 R718.2
CAN1.RX: sheet CT/RX, port CAN1.RX
CAN1.TX: sheet CT/TX, port CAN1.TX
CAN2.RX: sheet CT/RX, port CAN2.RX
CAN2.TX: sheet CT/TX, port CAN2.TX
CAN_H: J709.2 ; sheet CT/CAN_H
CAN_H: J706.2 ; sheet CT/CAN_H  [a separate net that carries the same name]
CAN_L: J709.3 ; sheet CT/CAN_L
CAN_L: J706.3 ; sheet CT/CAN_L  [a separate net that carries the same name]
I2C2.SCL: R713.2 R715.1 ; port I2C.SCL
I2C2.SDA: R714.2 R716.1 ; port I2C.SDA
SERIAL2.RX: R705.1 ; port SERIAL2.RX
SERIAL2.TX: R702.1 ; port SERIAL2.TX
SERIAL3.RX: R706.1 ; port SERIAL3.RX
SERIAL3.TX: R703.1 ; port SERIAL3.TX
SERIAL4.RX: R711.1 ; port SERIAL4.RX
SERIAL4.TX: R709.1 ; port SERIAL4.TX
SERIAL7.CTS: R707.1 ; port SERIAL7.CTS
SERIAL7.RTS: R708.1 ; port SERIAL7.RTS
SERIAL7.RX: R704.1 ; port SERIAL7.RX
SERIAL7.TX: R701.1 ; port SERIAL7.TX
SERIAL8.RX: R712.1 ; port SERIAL8.RX
SERIAL8.TX: R710.1 ; port SERIAL8.TX
USB.D_N: J708.A7(DN1) J708.B7(DN2) ; port USB.D_N
USB.D_P: J708.A6(DP1) J708.B6(DP2) ; port USB.D_P
NetJ701_2: J701.2 R701.2
NetJ701_3: J701.3 R704.2
NetJ701_4: J701.4 R707.2
NetJ701_5: J701.5 R708.2
NetJ702_2: J702.2 R702.2
NetJ702_3: J702.3 R705.2
NetJ703_2: J703.2 R703.2
NetJ703_3: J703.3 R706.2
NetJ704_2: J704.2 R709.2
NetJ704_3: J704.3 R711.2
NetJ705_2: J705.2 R710.2
NetJ705_3: J705.3 R712.2
NetJ707_2: J707.2 R715.2
NetJ707_3: J707.3 R716.2
NetJ708_A5: J708.A5(CC1) R717.1
NetJ708_B5: J708.B5(CC2) R718.1

Not connected (* = marked no-connect by the designer): J708 A8(SBU1)* B8(SBU2)*

### Layout directives
differential pair: USB.D_N, USB.D_P

### Notes on the sheet
- /

### Library data of the parts
J701 = CMP-17439-000166-1: CONN HEADER SMD 6POS 1.25MM; Number of Contacts: 6; Current Rating: 1A; Voltage Rating: 50V; Housing Material: Nylon; Lead Free: Lead Free; Pitch: 1.25mm; Packaging: Cut Tape; Number of Rows: 1; Series: GH; Contact Material: Bronze; Orientation: Straight; Termination: Solder; Mount: Surface Mount; Housing Color: Natural; Number of Positions: 6
J702-J707 J709 = CMP-17439-000062-2: CONN HEADER SMD 4POS 1.25MM; Number of Positions: 4; Wire/Cable Gauge: 26AWG; Current Rating: 1A; Voltage Rating (AC): 50V; Gender: Male; Orientation: Straight; Max Operating Temperature: 85°C; Pitch: 1.25mm; Contact Plating: Tin; Number of Rows: 4; Series: GH; Min Operating Temperature: -25°C; REACH SVHC: No SVHC; Packaging: Cut Tape; Lead Free: Lead Free; Voltage Rating: 50V; Contact Material: Bronze; Number of Contacts: 4; Termination: Crimp; Case/Package: SMD/SMT; Housing Color: Natural; Housing Material: Nylon
J708 = USB-TYPE-C-019: Connector Type:Type-C Standard:- Gender:Female Number of Contacts:16 Number of Ports:1 Mounting Style:Surface Mount Current Rating - Power (Max):3A Operating Temperature Range:-25℃~+85℃ Operating Temperature Range:-25℃~+85℃; Manufacturer: DEALON(德艺隆); Add into BOM: yes; Connector Type: Type-C; Gender: Female; Number of Contacts: 16; Number of Ports: 1; Current Rating - Power (Max): 3A; Symbol: USB-TYPE-C-019; Device: USB-TYPE-C-019; LCSC Part Name: Type-C 母座 卧贴; Supplier Part: C2927039; Manufacturer Part: USB-TYPE-C-019; Supplier Footprint: SMD; JLCPCB Part Class: Extended Part; Datasheet: https://atta.szlcsc.com/upload/public/pdf/source/20211217/CCD3D517E355E8E0CC52ABD8D5784AD8.pdf; Supplier: LCSC; Convert to PCB: yes; Standard: -; Mounting Style: Surface Mount; Operating Temperature Range: -25℃~+85℃
R701-R718 = Resistors: Resistor; Tolerance: 1%; Component Type: Resistors

## Sheet 8 can transceiver.SchDoc
size A4; SheetNumber: 8; SheetTotal: 9
Used 2 times, as channels CON/CT, CON/CT. Parts and nets are listed once, with the designators drawn on the sheet.
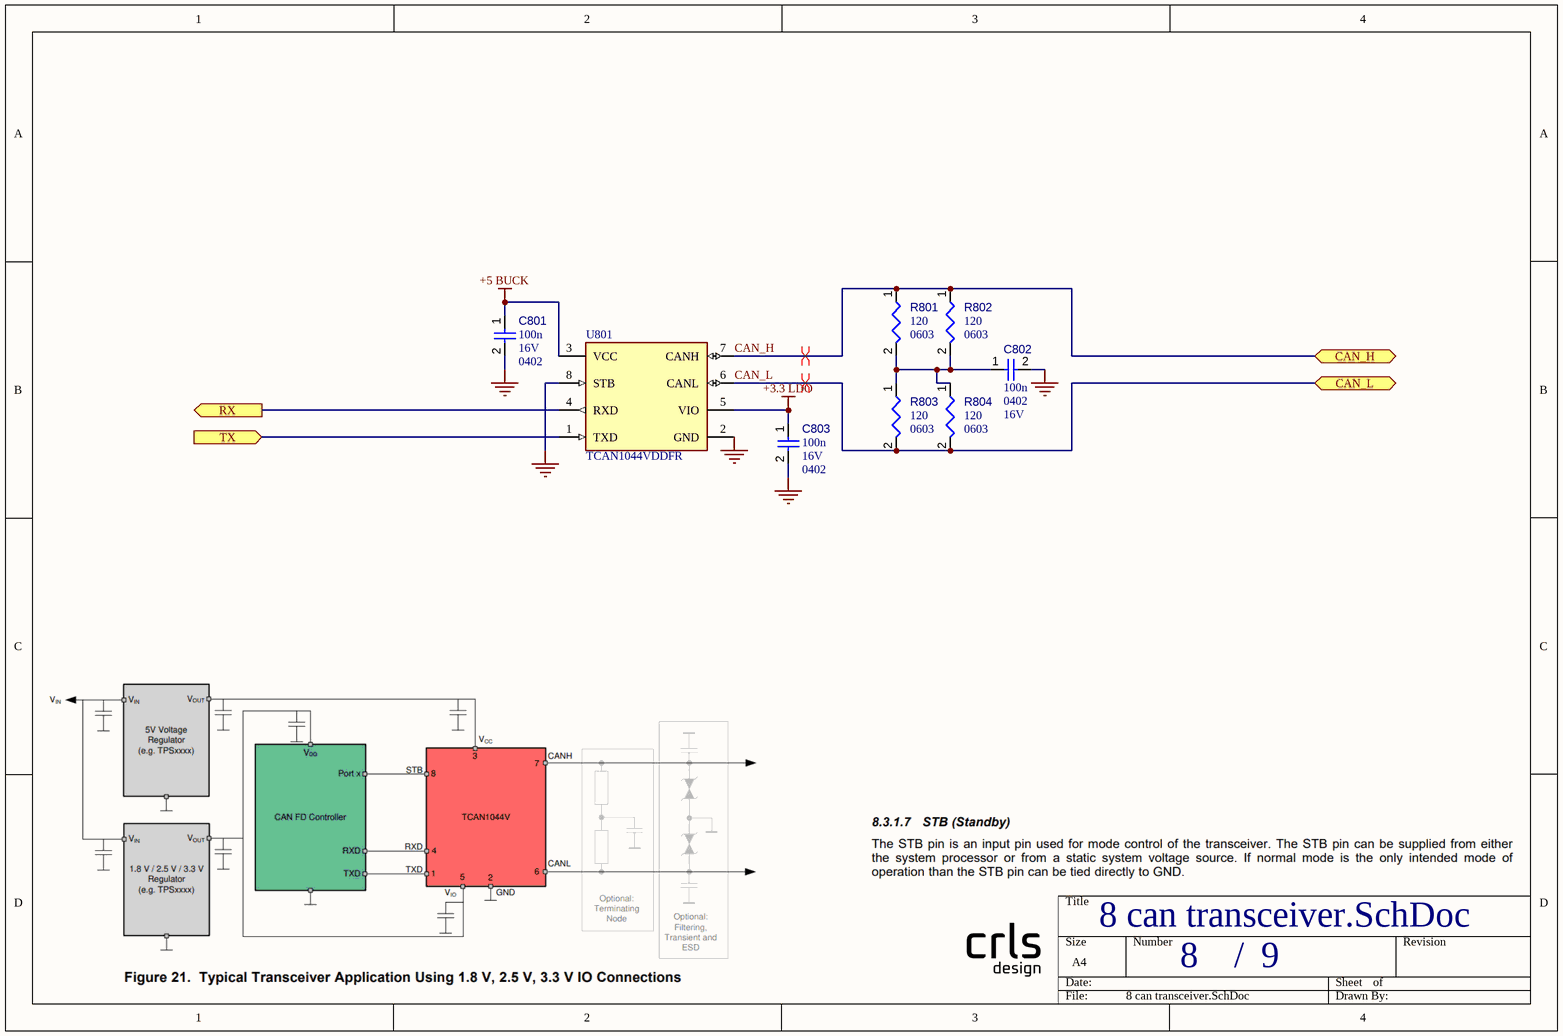
[diagram p7: 8 can transceiver.SchDoc]

### Parts
C801  value 100n  Case/Package: 0402  Voltage Rating: 16V  [CAPC0402(1005)60_L]  (hidden comment: Capacitors,0402,100n,16V)
C802  value 100n  Case/Package: 0402  Voltage Rating: 16V  [CAPC0402(1005)60_L]  (hidden comment: Capacitors,0402,100n,16V)
C803  value 100n  Case/Package: 0402  Voltage Rating: 16V  [CAPC0402(1005)60_L]  (hidden comment: Capacitors,0402,100n,16V)
R801  value 120  Case/Package: 0603  [RESC0603(1608)_L]  (hidden comment: Resistors,0603,1%,120)
R802  value 120  Case/Package: 0603  [RESC0603(1608)_L]  (hidden comment: Resistors,0603,1%,120)
R803  value 120  Case/Package: 0603  [RESC0603(1608)_L]  (hidden comment: Resistors,0603,1%,120)
R804  value 120  Case/Package: 0603  [RESC0603(1608)_L]  (hidden comment: Resistors,0603,1%,120)
U801  TCAN1044VDDFR  [FP-DDF0008A-MFG]

### Ports
CAN_H (bidir), CAN_L (bidir), RX (out), TX (in)

### Nets
+3.3 LDO: C803.1 U801.5(VIO)
+5 BUCK: C801.1 U801.3(VCC)
GND: C801.2 C802.2 C803.2 U801.2(GND) U801.8(STB)
CAN_H: R801.1 R802.1 U801.7(CANH) ; port CAN_H
CAN_L: R803.2 R804.2 U801.6(CANL) ; port CAN_L
RX: U801.4(RXD) ; port RX
TX: U801.1(TXD) ; port TX
NetC802_1: C802.1 R801.2 R802.2 R803.1 R804.1

### Channels
CON/CT: designators end in _CT2; ports CAN_H=CAN_H CAN_L=CAN_L RX=CAN1.RX TX=CAN1.TX
CON/CT: designators end in _CT1; ports CAN_H=CAN_H CAN_L=CAN_L RX=CAN2.RX TX=CAN2.TX

### Layout directives
differential pair: CAN_H, CAN_L

### Notes on the sheet
- /

### Library data of the parts
C801-C803 = Capacitors: Capacitor; Component Type: Capacitors
R801-R804 = Resistors: Resistor; Tolerance: 1%; Component Type: Resistors
U801 = CMP-04872-000216-1: IC TRANSCEIVER FULL 1/1 SOT23-8

## Sheet 9 pwm out.SchDoc
size A4; SheetNumber: 9; SheetTotal: 9
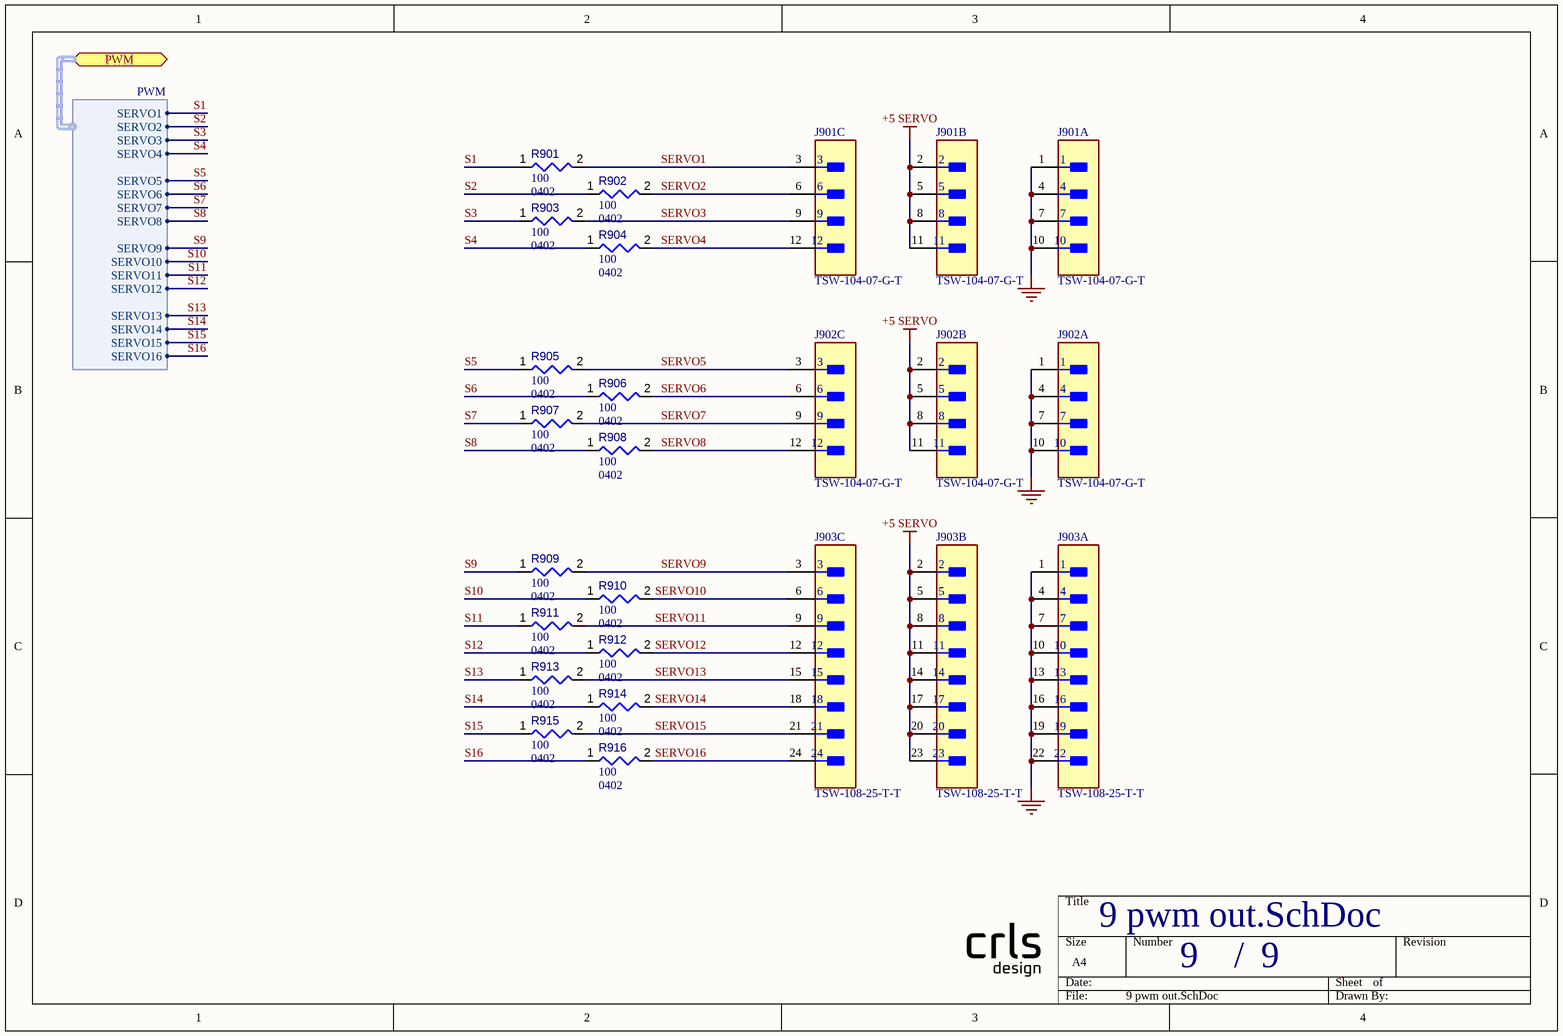
[diagram p8: 9 pwm out.SchDoc]

### Parts
J901  TSW-104-07-G-T  [FP-TSW-104-07-G-T-MFG]  (parts A,B,C of 3)
J902  TSW-104-07-G-T  [FP-TSW-104-07-G-T-MFG]  (parts A,B,C of 3)
J903  TSW-108-25-T-T  [FP-TSW-108-25-T-T-MFG]  (parts A,B,C of 3)
R901  value 100  Case/Package: 0402  [RESC0402(1005)_L]  (hidden comment: Resistors,0402,1%,100)
R902  value 100  Case/Package: 0402  [RESC0402(1005)_L]  (hidden comment: Resistors,0402,1%,100)
R903  value 100  Case/Package: 0402  [RESC0402(1005)_L]  (hidden comment: Resistors,0402,1%,100)
R904  value 100  Case/Package: 0402  [RESC0402(1005)_L]  (hidden comment: Resistors,0402,1%,100)
R905  value 100  Case/Package: 0402  [RESC0402(1005)_L]  (hidden comment: Resistors,0402,1%,100)
R906  value 100  Case/Package: 0402  [RESC0402(1005)_L]  (hidden comment: Resistors,0402,1%,100)
R907  value 100  Case/Package: 0402  [RESC0402(1005)_L]  (hidden comment: Resistors,0402,1%,100)
R908  value 100  Case/Package: 0402  [RESC0402(1005)_L]  (hidden comment: Resistors,0402,1%,100)
R909  value 100  Case/Package: 0402  [RESC0402(1005)_L]  (hidden comment: Resistors,0402,1%,100)
R910  value 100  Case/Package: 0402  [RESC0402(1005)_L]  (hidden comment: Resistors,0402,1%,100)
R911  value 100  Case/Package: 0402  [RESC0402(1005)_L]  (hidden comment: Resistors,0402,1%,100)
R912  value 100  Case/Package: 0402  [RESC0402(1005)_L]  (hidden comment: Resistors,0402,1%,100)
R913  value 100  Case/Package: 0402  [RESC0402(1005)_L]  (hidden comment: Resistors,0402,1%,100)
R914  value 100  Case/Package: 0402  [RESC0402(1005)_L]  (hidden comment: Resistors,0402,1%,100)
R915  value 100  Case/Package: 0402  [RESC0402(1005)_L]  (hidden comment: Resistors,0402,1%,100)
R916  value 100  Case/Package: 0402  [RESC0402(1005)_L]  (hidden comment: Resistors,0402,1%,100)

### Ports
PWM (bidir, harness PWM)

### Harnesses
PWM: SERVO1, SERVO2, SERVO3, SERVO4, SERVO5, SERVO6, SERVO7, SERVO8, SERVO9, SERVO10, SERVO11, SERVO12, SERVO13, SERVO14, SERVO15, SERVO16

### Nets
+5 SERVO: J901.2 J901.5 J901.8 J901.11 J902.2 J902.5 J902.8 J902.11 J903.2 J903.5 J903.8 J903.11 J903.14 J903.17 J903.20 J903.23
GND: J901.1 J901.4 J901.7 J901.10 J902.1 J902.4 J902.7 J902.10 J903.1 J903.4 J903.7 J903.10 J903.13 J903.16 J903.19 J903.22
S1: R901.1 ; port PWM.SERVO1  [project net PWM.SERVO1]
S2: R902.1 ; port PWM.SERVO2  [project net PWM.SERVO2]
S3: R903.1 ; port PWM.SERVO3  [project net PWM.SERVO3]
S4: R904.1 ; port PWM.SERVO4  [project net PWM.SERVO4]
S5: R905.1 ; port PWM.SERVO5  [project net PWM.SERVO5]
S6: R906.1 ; port PWM.SERVO6  [project net PWM.SERVO6]
S7: R907.1 ; port PWM.SERVO7  [project net PWM.SERVO7]
S8: R908.1 ; port PWM.SERVO8  [project net PWM.SERVO8]
S9: R909.1 ; port PWM.SERVO9  [project net PWM.SERVO9]
S10: R910.1 ; port PWM.SERVO10  [project net PWM.SERVO10]
S11: R911.1 ; port PWM.SERVO11  [project net PWM.SERVO11]
S12: R912.1 ; port PWM.SERVO12  [project net PWM.SERVO12]
S13: R913.1 ; port PWM.SERVO13  [project net PWM.SERVO13]
S14: R914.1 ; port PWM.SERVO14  [project net PWM.SERVO14]
S15: R915.1 ; port PWM.SERVO15  [project net PWM.SERVO15]
S16: R916.1 ; port PWM.SERVO16  [project net PWM.SERVO16]
SERVO1: J901.3 R901.2
SERVO2: J901.6 R902.2
SERVO3: J901.9 R903.2
SERVO4: J901.12 R904.2
SERVO5: J902.3 R905.2
SERVO6: J902.6 R906.2
SERVO7: J902.9 R907.2
SERVO8: J902.12 R908.2
SERVO9: J903.3 R909.2
SERVO10: J903.6 R910.2
SERVO11: J903.9 R911.2
SERVO12: J903.12 R912.2
SERVO13: J903.15 R913.2
SERVO14: J903.18 R914.2
SERVO15: J903.21 R915.2
SERVO16: J903.24 R916.2

### Notes on the sheet
- /

### Library data of the parts
J901 J902 = CMP-1024-00347-2: CONN HEADER VERT 12POS 2.54MM; Manufacturer: Samtec; Conn Orientation: Straight; Number Of Contacts: 12; Conn Gender: Male; Automotive: No; RoHS: TRUE; Number Of Rows: 3; Footprint Url: http://suddendocs.samtec.com/prints/tsw-xxx-xx-x-x-xx-xxx-footprint.pdf; Manufacturer Part Number: TSW-104-07-G-T; Temperature Range High: +125°C; Device Class L2: Headers and Wire Housings; Digikey Description: CONN HEADER VERT 12POS 2.54MM; Pitch: 2.54mm; Device Class L1: Connectors; Category: Conn; Device Class L3: unset; Octopart: https://octopart.com/tsw-104-07-g-t-samtec-8296723; Package: TSW-104-07-G-T; Lead Free: Yes; Height: 8.64mm; ComponentLink2Description: Datasheet; Contact Material: Gold,Nickel; Temperature Range Low: -55°C; ComponentLink2URL: http://suddendocs.samtec.com/prints/tsw-xxx-xx-xxx-x-xx-xxx-mkt.pdf; Temperature: -55°C to +125°C
J903 = CMP-02766-000094-1: CONN HEADER VERT 24POS 2.54MM; Number of Contacts: 24; Gender: Male; Termination: Solder; Contact Plating: Tin; REACH SVHC: No SVHC; Number of Rows: 3; Mount: Through Hole; Pitch: 2.54mm; Contact Material: Bronze; Radiation Hardening: No; Packaging: Bulk
R901-R916 = Resistors: Resistor; Tolerance: 1%; Component Type: Resistors

## Nets that join several sheets
+1.8 LDO: 4 sensors (11 pins), 2 power (C225.1 U203.5)
+3.3 LDO: 3 mcu (18 pins), 4 sensors (11 pins), 5 sd card (7 pins), 2 power (8 pins), 7 connectors (R713.1 R714.1), CON/CT (C803_CT2.1 U801_CT2.5), CON/CT (C803_CT1.1 U801_CT1.5)
+5 BUCK: 6 led (8 pins), 2 power (13 pins), 7 connectors (8 pins), CON/CT (C801_CT2.1 U801_CT2.3), CON/CT (C801_CT1.1 U801_CT1.3)
+5 USB: 2 power (D201.2), 7 connectors (J708.A4B9 J708.B4A9)
GND: 3 mcu (23 pins), 4 sensors (33 pins), 5 sd card (6 pins), 6 led (8 pins), 2 power (31 pins), 7 connectors (32 pins), CON/CT (5 pins), CON/CT (5 pins), 9 pwm out (16 pins)
BARO_I2C1.SCL: 3 mcu (U301.B5), 4 sensors (R401.2 U404.2)
BARO_I2C1.SDA: 3 mcu (U301.A5), 4 sensors (R402.2 U404.4)
CAN1.RX: 3 mcu (U301.B4), CON/CT (U801_CT2.4)
CAN1.TX: 3 mcu (U301.A4), CON/CT (U801_CT2.1)
CAN2.RX: 3 mcu (U301.K8), CON/CT (U801_CT1.4)
CAN2.TX: 3 mcu (U301.J8), CON/CT (U801_CT1.1)
CAN_H: 7 connectors (J709.2), CON/CT (R801_CT1.1 R802_CT1.1 U801_CT1.7)
CAN_H: 7 connectors (J706.2), CON/CT (R801_CT2.1 R802_CT2.1 U801_CT2.7)
CAN_L: 7 connectors (J709.3), CON/CT (R803_CT1.2 R804_CT1.2 U801_CT1.6)
CAN_L: 7 connectors (J706.3), CON/CT (R803_CT2.2 R804_CT2.2 U801_CT2.6)
I2C2.SCL: 3 mcu (U301.J7), 7 connectors (R713.2 R715.1)
I2C2.SDA: 3 mcu (U301.K7), 7 connectors (R714.2 R716.1)
IMU1_SPI2.CS: 3 mcu (U301.B1), 4 sensors (U401.12)
IMU1_SPI2.INT: 3 mcu (U301.F1), 4 sensors (U401.4)
IMU1_SPI2.MISO: 3 mcu (U301.E2), 4 sensors (U401.1)
IMU1_SPI2.MOSI: 3 mcu (U301.F2), 4 sensors (U401.14)
IMU1_SPI2.SCK: 3 mcu (U301.C7), 4 sensors (U401.13)
IMU2_SPI3.CS: 3 mcu (U301.A8), 4 sensors (U402.12)
IMU2_SPI3.INT: 3 mcu (U301.B7), 4 sensors (U402.4)
IMU2_SPI3.MISO: 3 mcu (U301.B8), 4 sensors (U402.1)
IMU2_SPI3.MOSI: 3 mcu (U301.C8), 4 sensors (U402.14)
IMU2_SPI3.SCK: 3 mcu (U301.B9), 4 sensors (U402.13)
IMU3_SPI4.CS: 3 mcu (U301.H3), 4 sensors (U403.12)
IMU3_SPI4.INT: 3 mcu (U301.H4), 4 sensors (U403.4)
IMU3_SPI4.MISO: 3 mcu (U301.K6), 4 sensors (U403.1)
IMU3_SPI4.MOSI: 3 mcu (U301.E3), 4 sensors (U403.14)
IMU3_SPI4.SCK: 3 mcu (U301.J6), 4 sensors (U403.13)
PWM.SERVO1: 3 mcu (U301.K3), 9 pwm out (R901.1)
PWM.SERVO2: 3 mcu (U301.J3), 9 pwm out (R902.1)
PWM.SERVO3: 3 mcu (U301.K4), 9 pwm out (R903.1)
PWM.SERVO4: 3 mcu (U301.J4), 9 pwm out (R904.1)
PWM.SERVO5: 3 mcu (U301.K10), 9 pwm out (R905.1)
PWM.SERVO6: 3 mcu (U301.J10), 9 pwm out (R906.1)
PWM.SERVO7: 3 mcu (U301.H8), 9 pwm out (R907.1)
PWM.SERVO8: 3 mcu (U301.G8), 9 pwm out (R908.1)
PWM.SERVO9: 3 mcu (U301.F9), 9 pwm out (R909.1)
PWM.SERVO10: 3 mcu (U301.F10), 9 pwm out (R910.1)
PWM.SERVO11: 3 mcu (U301.E9), 9 pwm out (R911.1)
PWM.SERVO12: 3 mcu (U301.E10), 9 pwm out (R912.1)
PWM.SERVO13: 3 mcu (U301.G7), 9 pwm out (R913.1)
PWM.SERVO14: 3 mcu (U301.D9), 9 pwm out (R914.1)
PWM.SERVO15: 3 mcu (U301.D10), 9 pwm out (R915.1)
PWM.SERVO16: 3 mcu (U301.C9), 9 pwm out (R916.1)
SDMMC2.CK: 3 mcu (U301.C6), 5 sd card (J501.5)
SDMMC2.CMD: 3 mcu (U301.D6), 5 sd card (J501.3 R501.2)
SDMMC2.D0: 3 mcu (U301.H10), 5 sd card (J501.7 R502.2)
SDMMC2.D1: 3 mcu (U301.G10), 5 sd card (J501.8 R503.2)
SDMMC2.D2: 3 mcu (U301.A7), 5 sd card (J501.1 R504.2)
SDMMC2.D3: 3 mcu (U301.A6), 5 sd card (J501.2 R505.2)
SERIAL2.RX: 3 mcu (U301.K2), 7 connectors (R705.1)
SERIAL2.TX: 3 mcu (U301.J2), 7 connectors (R702.1)
SERIAL3.RX: 3 mcu (U301.J9), 7 connectors (R706.1)
SERIAL3.TX: 3 mcu (U301.K9), 7 connectors (R703.1)
SERIAL4.RX: 3 mcu (U301.D8), 7 connectors (R711.1)
SERIAL4.TX: 3 mcu (U301.E8), 7 connectors (R709.1)
SERIAL7.CTS: 3 mcu (U301.G6), 7 connectors (R707.1)
SERIAL7.RTS: 3 mcu (U301.K5), 7 connectors (R708.1)
SERIAL7.RX: 3 mcu (U301.H5), 7 connectors (R704.1)
SERIAL7.TX: 3 mcu (U301.J5), 7 connectors (R701.1)
SERIAL8.RX: 3 mcu (U301.D4), 7 connectors (R712.1)
SERIAL8.TX: 3 mcu (U301.C4), 7 connectors (R710.1)
USB.D_N: 3 mcu (U301.C10), 7 connectors (J708.A7 J708.B7)
USB.D_P: 3 mcu (U301.B10), 7 connectors (J708.A6 J708.B6)
V_SENSE: 3 mcu (U301.H2), 2 power (C201.1 R201.2 R202.1)